# EAGLE board A20-OLinuXino-Lime2_Rev_K (EAGLE 4.16), part 1 of 6
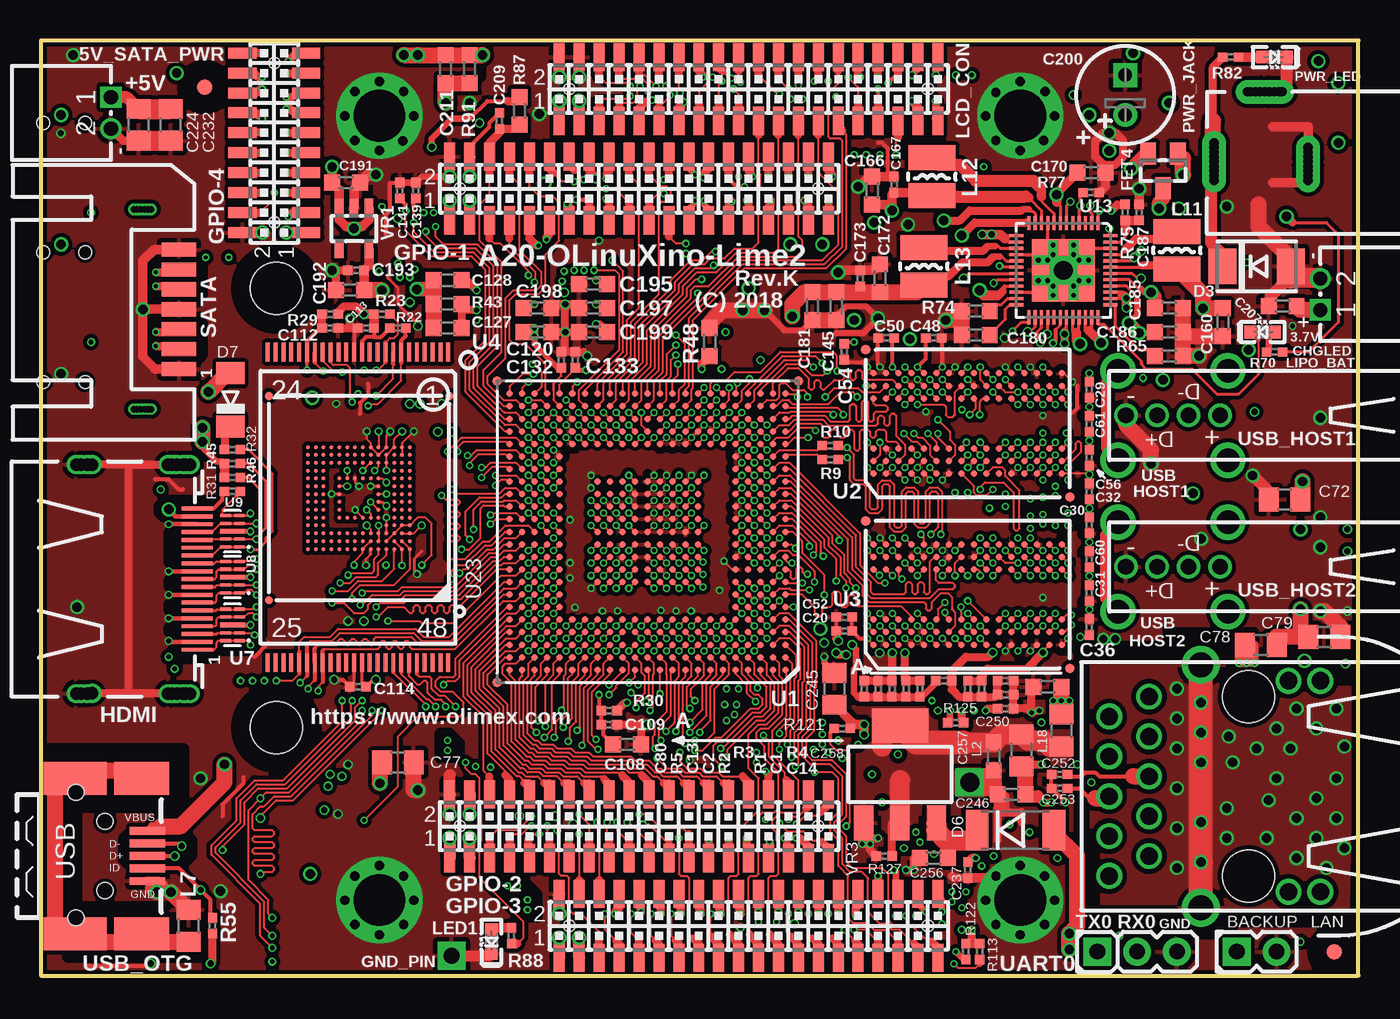
[diagram p5: board, top side]
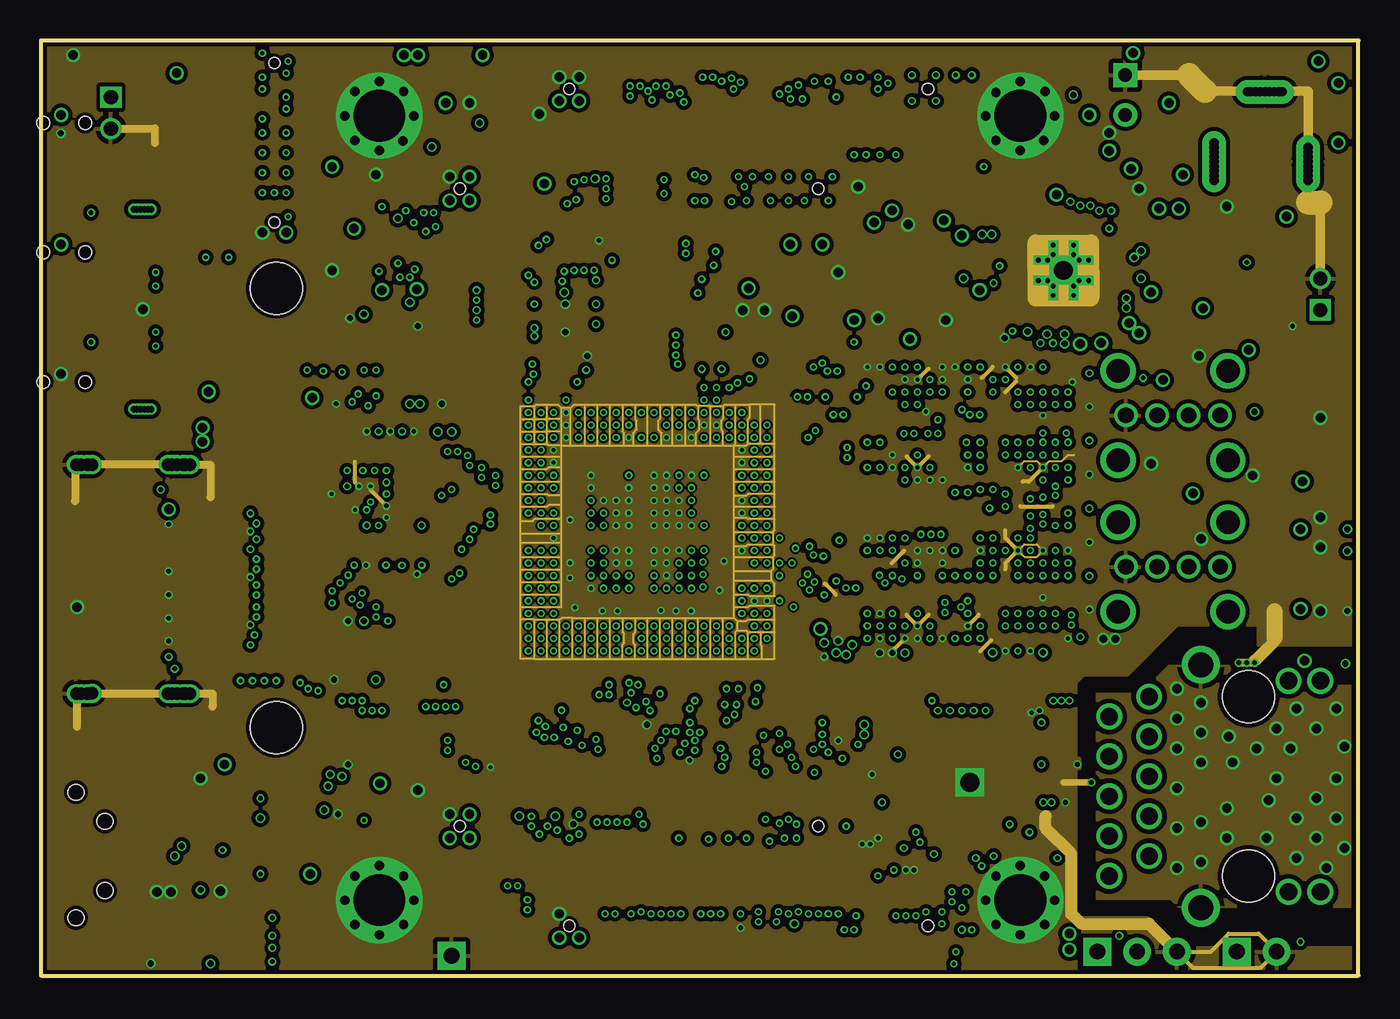
[diagram p6: board, inner layer GND]
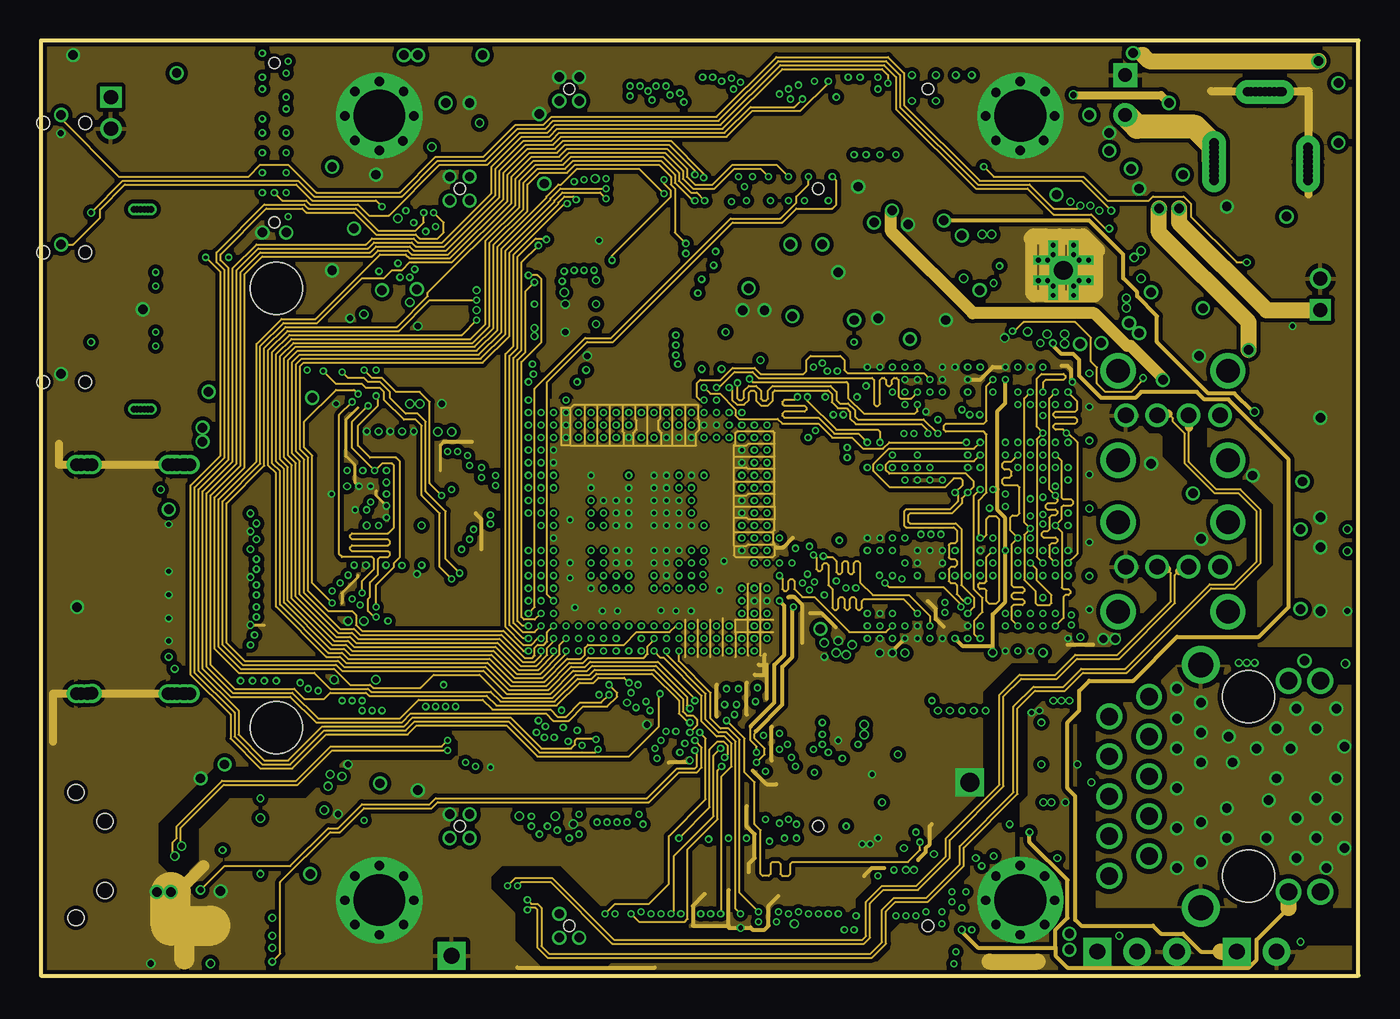
[diagram p7: board, inner layer Route3]
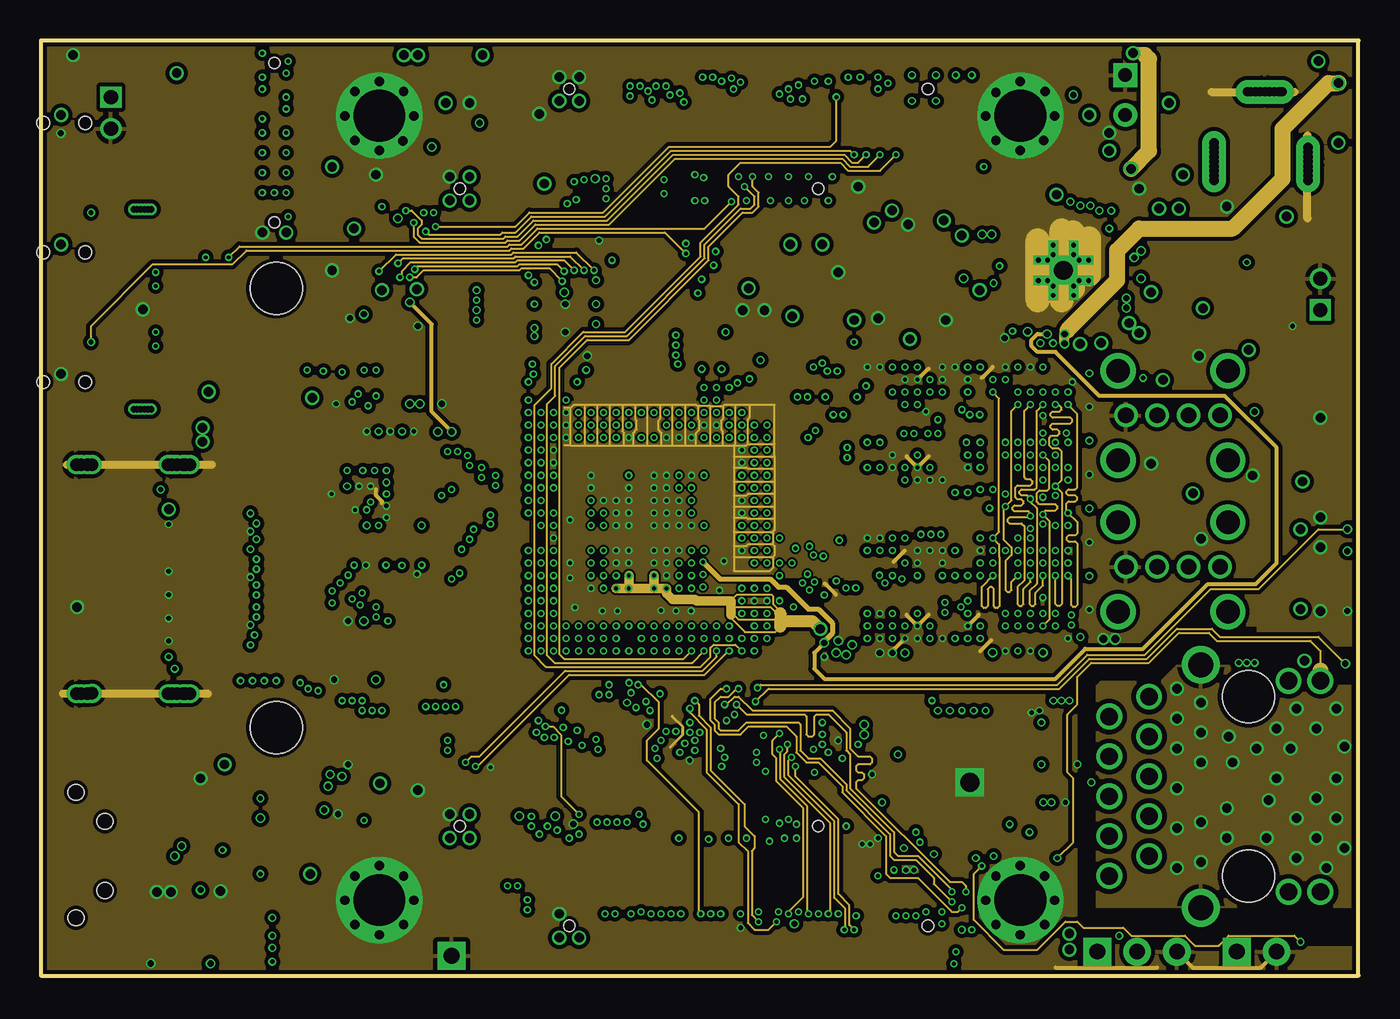
[diagram p8: board, inner layer Route4]
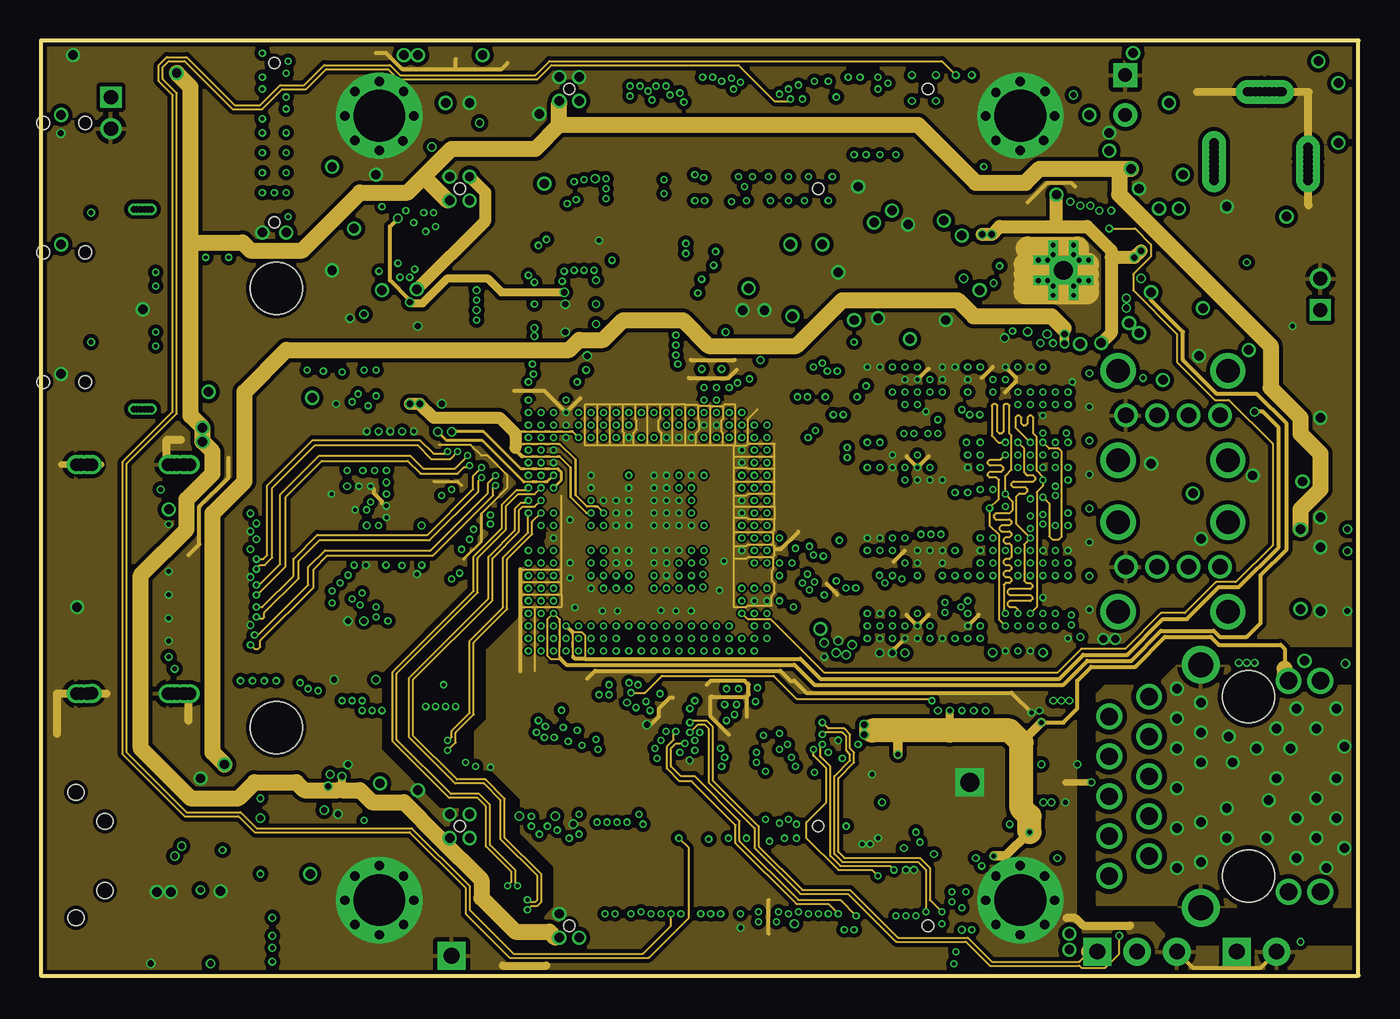
[diagram p9: board, inner layer Route13]
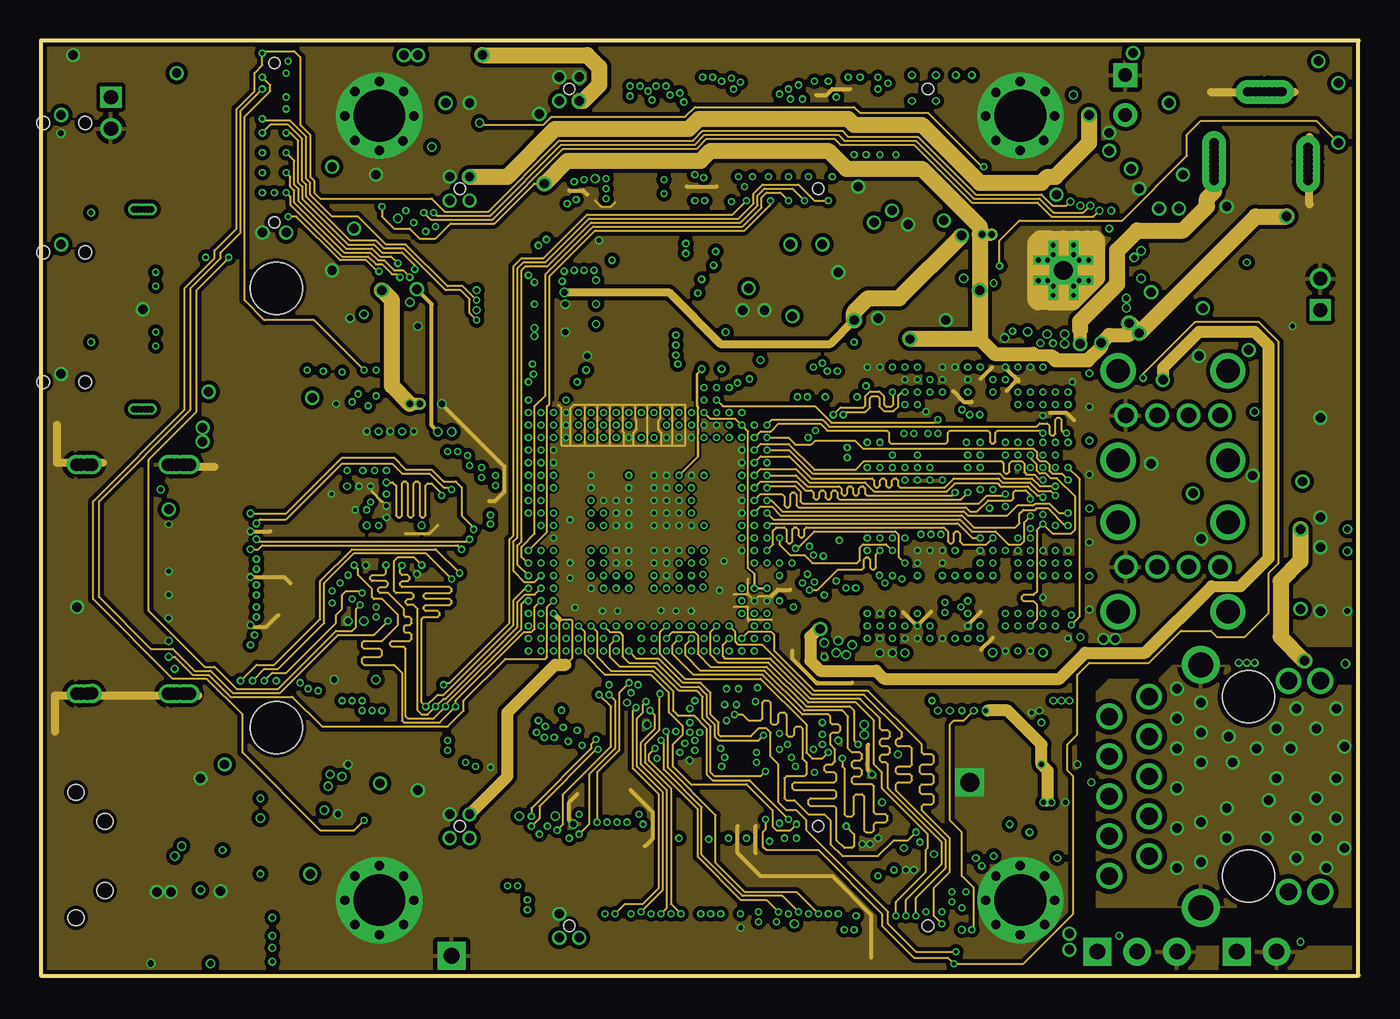
[diagram p10: board, inner layer Route14]
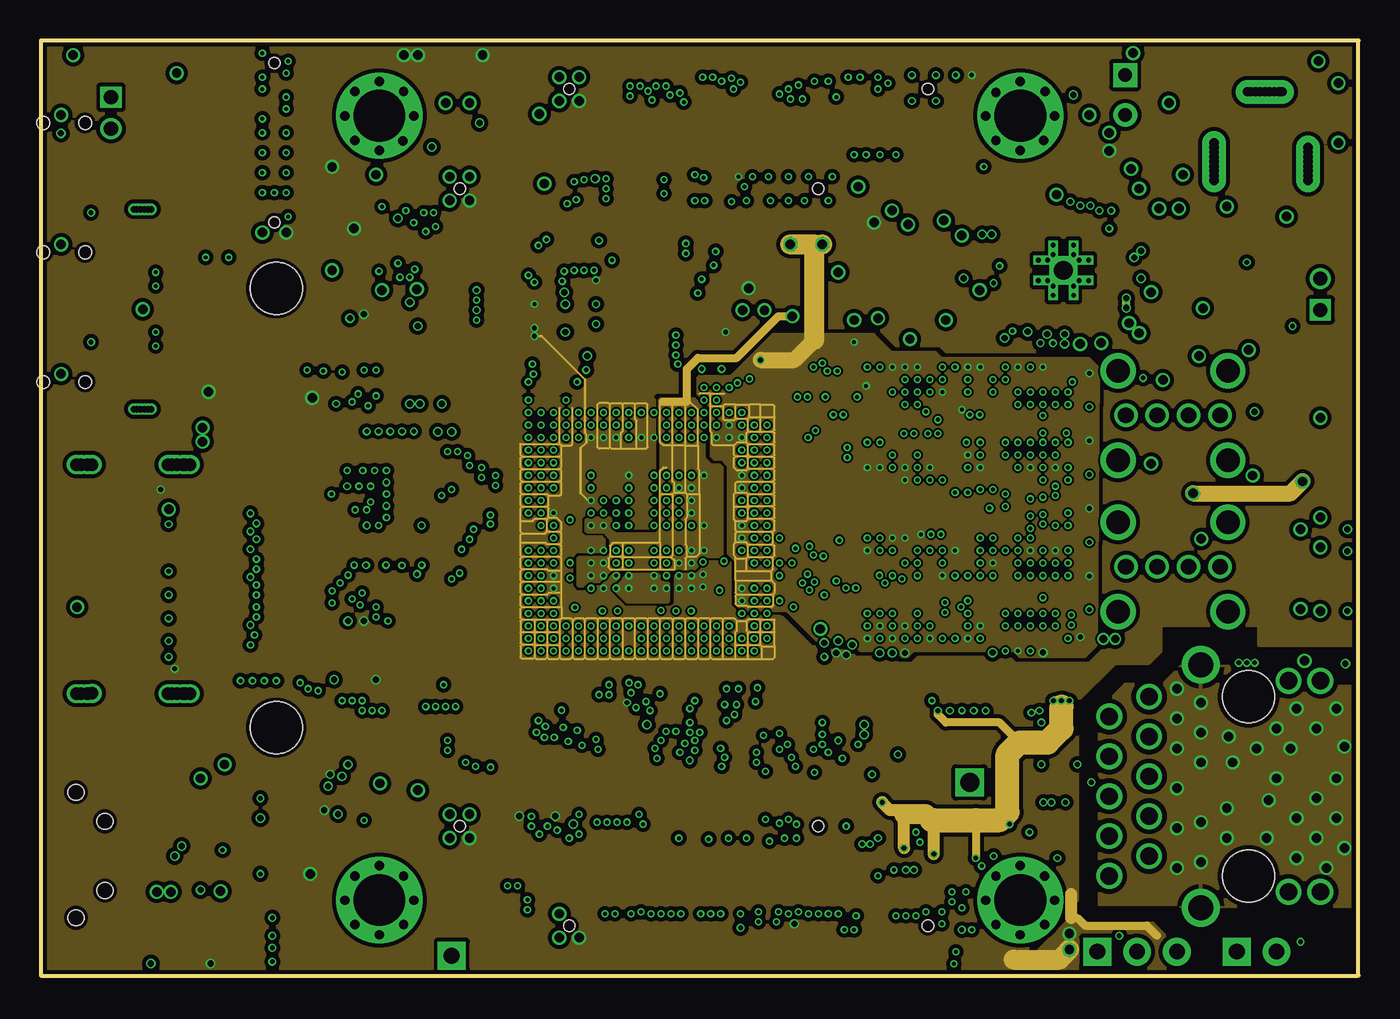
[diagram p11: board, inner layer PWR]
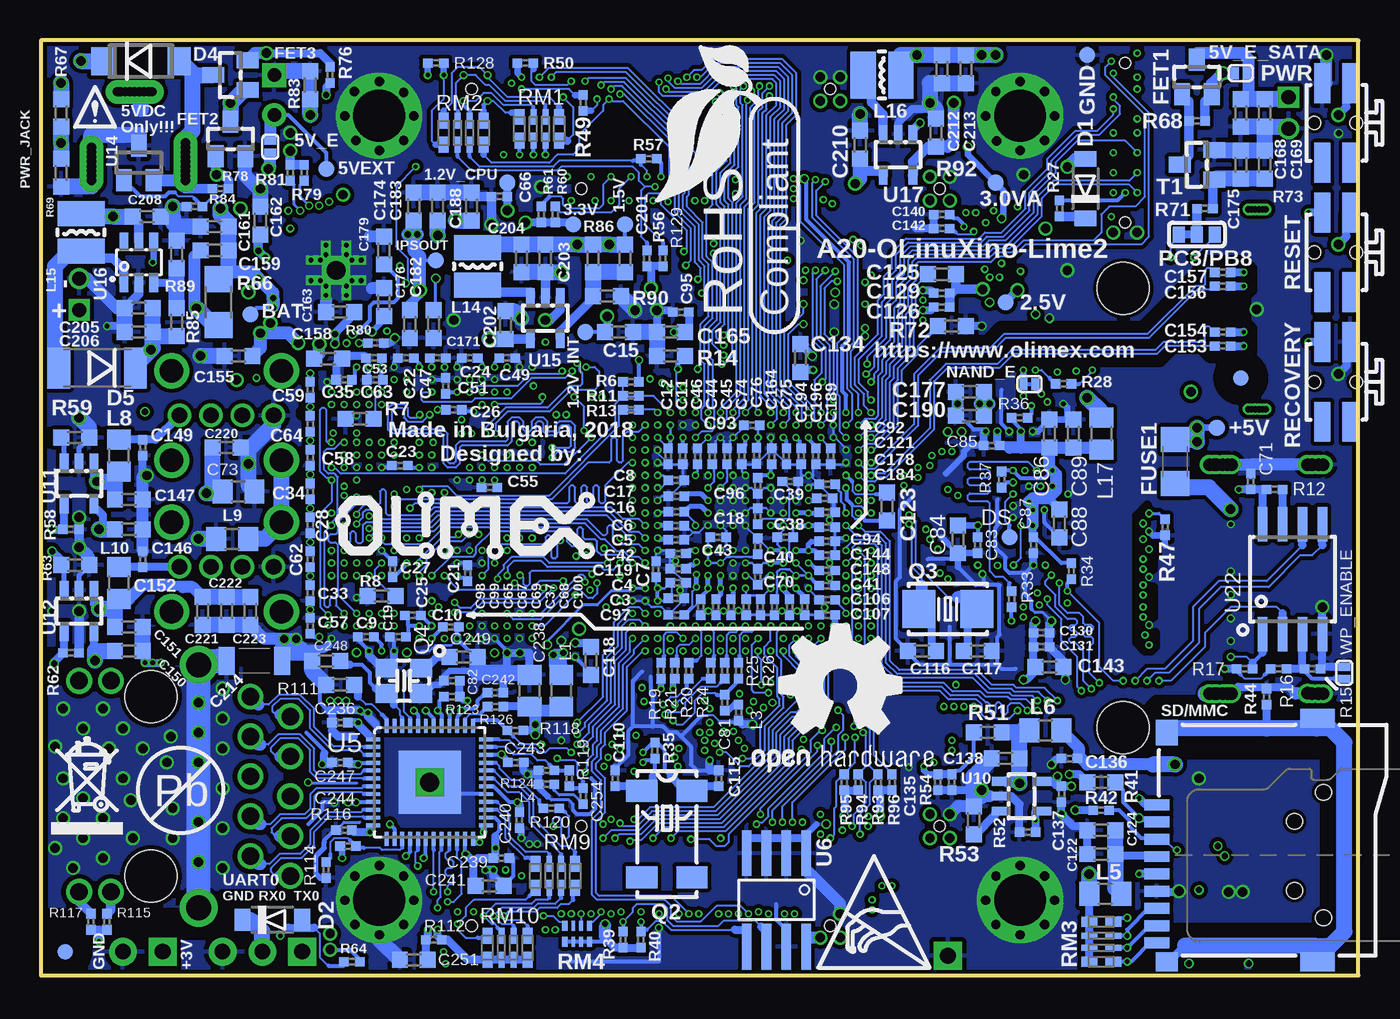
[diagram p12: board, bottom side, seen from below]

Size 83.96 x 59.61 mm. Coordinates in mm from the lower left corner, seen from the top.
Copper layers (1+2*3+4*13+14*15+16): Top 0.035mm / dielectric 0.12mm / GND 0.035mm / dielectric 0.2mm / Route3 0.035mm / dielectric 0.28mm / Route4 0.035mm / dielectric 0.2mm / Route13 0.035mm / dielectric 0.28mm / Route14 0.035mm / dielectric 0.2mm / PWR 0.035mm / dielectric 0.12mm / Bottom 0.035mm
Design rules "default": minimum track width 4.5mil, minimum drill 10mil, track to track 5mil, track to pad 5mil, pad to pad 5mil, via to via 5mil, smd to smd 1mil, copper to edge 10mil, drill to drill 8mil, minimum pad ring 6mil, minimum via ring 4mil, stop-mask expansion 4mil, vias tented up to drill 25mil, thermal gap 12mil
Net classes: 2 lan_sh: drill 0.762 mm
tRestrict: 171 lines
bRestrict: 117 lines

## Footprints (pad centres in the part's own frame; a part is rotated, then mirrored left to right if it is on the bottom)
TESTPAD_40-ROUND = smd 1.016 x 1.016: 1 0,0
SJ_1_SMALLER = smd 0.508 x 0.762: 1 -0.381,0; 2 0.381,0
DW02R = drill 0.9 square: 1 -1,0 | drill 0.9 round: 2 1,0
HN1X2 = drill 1 pad 1.778 square: 1 -1.27,0 | drill 1 pad 1.778 round: 2 1.27,0
HAMMOND_1593LBK_A10_LIME_METALBOX = drill 3.3 pad 5.5 round: SH0 21.55,54.81; SH9 62.41,54.81; SH18 21.55,4.81; SH27 62.41,4.81 | drill 0.6 pad 0.9 round: SH1 21.55,57; SH2 23.1,56.35; SH3 23.75,54.8; SH4 23.05,53.2; SH5 21.55,52.6; SH6 20,53.25; SH7 19.35,54.8; SH8 20,56.35; SH10 62.4,57; SH11 64,56.35; SH12 64.6,54.8; SH13 63.9,53.25; SH14 62.4,52.6; SH15 60.85,53.25; SH16 60.2,54.8; SH17 60.85,56.3; SH19 21.55,7; SH20 23.1,6.35; SH21 23.75,4.8; SH22 23.1,3.25; SH23 21.55,2.6; SH24 20,3.25; SH25 19.35,4.8; SH26 20,6.35; SH28 62.4,7; SH29 63.95,6.35; SH30 64.6,4.8; SH31 63.95,3.25; SH32 62.4,2.6; SH33 60.85,3.25; SH34 60.2,4.8; SH35 60.85,6.35 | hole 3.3: 14.98,15.81; 14.98,43.81
C0402_TI = smd 0.61 x 0.584: 1 -0.508,0; 2 0.508,0
C0603_DWS = smd 1.016 x 1.016: 1 -0.889,0; 2 0.889,0
C0805_5MIL_DWS = smd 1.27 x 1.524: 1 -1.016,0; 2 1.016,0
E2,5-6,3 = drill 0.864 pad 1.524 round: + -1.27,0 | drill 0.864 pad 1.524 square: - 1.27,0
C1206_5MILS_WS_ISO = smd 1.016 x 1.778: 1 -1.778,0; 2 1.778,0
LED-0603_TEST = smd 0.8 x 0.8: A 0.762,0; C -0.762,0
SOD-123 = smd 1 x 1.4: A 1.9,0; C -1.9,0
DO214AA = smd 1.778 x 2.286: A 2.177,0; C -2.177,0
MLL-41 = smd 1.45 x 1.8: A 2.445,0; K -2.445,0
MELF-MLL41 = smd 1.45 x 2.6: 1 -2.445,0; 2 2.445,0
MINI-MELF = smd 1.4 x 1.8: A 1.7,0; C -1.7,0
SOT23 = smd 1.4 x 1: 1 1.1,-0.95; 2 1.1,0.95; 3 -1.1,0
1206 = smd 1.6 x 1.8: 1 -1.4,0; 2 1.4,0
TEST_PAD40/70/SQUARE = drill 1.016 pad 1.778 square: P$1 0,0
GPH127SMT-02X20(PA-V16X-2X20-LF)_TEST = smd 0.7 x 1.8: 1 -12.065,-2.032; 2 -12.065,2.032; 3 -10.795,-2.032; 4 -10.795,2.032; 5 -9.525,-2.032; 6 -9.525,2.032; 7 -8.255,-2.032; 8 -8.255,2.032; 9 -6.985,-2.032; 10 -6.985,2.032; 11 -5.715,-2.032; 12 -5.715,2.032; 13 -4.445,-2.032; 14 -4.445,2.032; 15 -3.175,-2.032; 16 -3.175,2.032; 17 -1.905,-2.032; 18 -1.905,2.032; 19 -0.635,-2.032; 20 -0.635,2.032; 21 0.635,-2.032; 22 0.635,2.032; 23 1.905,-2.032; 24 1.905,2.032; 25 3.175,-2.032; 26 3.175,2.032; 27 4.445,-2.032; 28 4.445,2.032; 29 5.715,-2.032; 30 5.715,2.032; 31 6.985,-2.032; 32 6.985,2.032; 33 8.255,-2.032; 34 8.255,2.032; 35 9.525,-2.032; 36 9.525,2.032; 37 10.795,-2.032; 38 10.795,2.032; 39 12.065,-2.032; 40 12.065,2.032 | hole 0.7: -11.43,0; 11.43,0
GPH127SMT-02X10(PA-V16X-2X10-LF)_TEST = smd 0.7 x 1.8: 1 -5.715,-2.032; 2 -5.715,2.032; 3 -4.445,-2.032; 4 -4.445,2.032; 5 -3.175,-2.032; 6 -3.175,2.032; 7 -1.905,-2.032; 8 -1.905,2.032; 9 -0.635,-2.032; 10 -0.635,2.032; 11 0.635,-2.032; 12 0.635,2.032; 13 1.905,-2.032; 14 1.905,2.032; 15 3.175,-2.032; 16 3.175,2.032; 17 4.445,-2.032; 18 4.445,2.032; 19 5.715,-2.032; 20 5.715,2.032 | hole 0.7: -5.08,0; 5.08,0
HDMI-SWM-19_TEST = smd 0.25 x 2: 1 -4.5,-5.75; 2 -4,-5.75; 3 -3.5,-5.75; 4 -3,-5.75; 5 -2.5,-5.75; 6 -2,-5.75; 7 -1.5,-5.75; 8 -1,-5.75; 9 -0.5,-5.75; 10 0,-5.75; 11 0.5,-5.75; 12 1,-5.75; 13 1.5,-5.75; 14 2,-5.75; 15 2.5,-5.75; 16 3,-5.75; 17 3.5,-5.75; 18 4,-5.75; 19 4.5,-5.75 | drill 0.8 round: P$5 -7.3,-4.85; P$7 -7.3,1.25; P$9 7.3,1.25; P$11 7.3,-4.85; P$13 -7.3,-4.45; P$15 -7.3,1.65; P$18 7.3,1.65; P$20 7.3,-4.45; P$21 -7.3,-4.15; P$22 -7.3,-5; P$23 7.3,-5; P$24 7.3,-4.15; P$25 -7.3,-5.3; P$26 7.3,-5.3; P$27 7.3,0.95; P$28 -7.275,0.95; SH1 -7.3,-3.9; SH2 -7.3,1.95; SH3 7.3,1.95; SH4 7.3,-3.9
L0805_5MIL_DWS = smd 1.27 x 1.524: 1 -1.016,0; 2 1.016,0
L0402_TI = smd 0.61 x 0.584: 1 -0.508,0; 2 0.508,0
CD32 = smd 1.6 x 3: 1 -1.2,0; 2 1.2,0
TM211Q01FM22_SH = drill 1.1 round: 1 -5.715,-6.35; 2 -4.445,-8.89; 3 -3.175,-6.35; 4 -1.905,-8.89; 5 -0.635,-6.35; 6 0.635,-8.89; 7 1.905,-6.35; 8 3.175,-8.89; 9 4.445,-6.35; 10 5.715,-8.89; 11 -6.731,2.54; 12 -6.731,4.572; 13 6.731,2.54; 14 6.731,4.572 | drill 1.6 round: SH1 -7.747,-3.048; SH2 7.747,-3.048 | hole 3.3: 5.715,0; -5.715,0
SJ_1_SMALLER_CLOSE_10MILS = smd 0.508 x 0.762: 1 -0.381,0; 2 0.381,0
SJ_2_SMALL_23_TIED = smd 0.762 x 1.016: 1 -1.143,0; 2 0,0; 3 1.143,0
SW_TAKT3X4 = smd 2.54 x 1.016: 1_1 2.54,-0.889; 1_2 -2.54,-0.889; 2_1 2.54,0.889; 2_2 -2.54,0.889 | hole 0.8: 0,1.397; 0,-1.27
PWR_JACK_UNI_MILLING_SMALLER_DRILLS = drill 0.6 pad 1.5 round: + -0.196,4.75; +1 -0.196,5.05; +2 -0.196,5.35; +3 -0.196,5.65; +4 -0.196,4.45; +5 -0.196,4.15; +6 -0.196,3.85; +7 -0.196,3.55; +8 -0.196,5.95; - -6.196,4.75; -1 -6.196,5.05; -2 -6.196,5.35; -3 -6.196,4.45; -4 -6.196,4.15; -5 -6.196,5.65; -6 -6.196,3.85; -8 -6.196,5.95; -- -3.446,0.3; --1 -3.746,0.3; --2 -4.046,0.3; --3 -4.346,0.3; --4 -3.146,0.3; --5 -2.846,0.3; --6 -2.546,0.3; --14 -4.546,0.3; --15 -2.346,0.3
MC-306_TEST = smd 1.4 x 2: 1 -2.75,-1.6; 2 2.75,-1.6; 3 2.75,1.6; 4 -2.75,1.6
HCX-4S_TEST = smd 2.1 x 2.4: 1 -1.85,0; 2 1.85,0
NX3225SA = smd 1.4 x 1.2: 1 -1.1,-0.8; 2 1.1,0.8; NC_1 1.1,-0.8; NC_2 -1.1,0.8
R0402_TI = smd 0.61 x 0.584: 1 -0.508,0; 2 0.508,0
R0603_5MIL_DWS = smd 1.016 x 1.016: 1 -0.889,0; 2 0.889,0
R0402_TI_0R = smd 0.61 x 0.584: 1 -0.508,0; 2 0.508,0
R1206_5MIL_WS = smd 1.651 x 1.778: 1 -1.46,0; 2 1.46,0
0603_0R = smd 1.016 x 1.016: 1 -0.889,0; 2 0.889,0
R_MATRIX_4 = smd 0.635 x 1.016: 1.1 -1.27,-0.762; 1.2 -1.27,0.762; 4.1 1.27,-0.762; 4.2 1.27,0.762 | smd 0.381 x 1.016: 2.1 -0.381,-0.762; 2.2 -0.381,0.762; 3.1 0.381,-0.762; 3.2 0.381,0.762
R_MATRIX_4_0402_25X625_BIGGEROUTPADS = smd 0.325 x 0.625: 1.1 -0.79,-0.512; 1.2 -0.79,0.512; 4.1 0.79,-0.512; 4.2 0.79,0.512 | smd 0.25 x 0.625: 2.1 -0.25,-0.512; 2.2 -0.25,0.512; 3.1 0.25,-0.512; 3.2 0.25,0.512
SATA-PWA-07-TEST = smd 0.9 x 2.2: 1 -4.25,-4.8; 2 -2.98,-4.8; 3 -1.71,-4.8; 4 -0.44,-4.8; 5 0.83,-4.8; 6 2.1,-4.8; 7 3.37,-4.8 | drill 0.4 round: P$1 -6.81,-2.35; P$2 -6.81,-2.125; P$3 -6.81,-2.6; P$4 -6.81,-1.925; P$5 -6.81,-3.025; P$11 5.93,-2.35; P$20 5.93,-2.125; P$23 5.93,-2.6; P$24 5.93,-1.925; P$26 5.93,-3.025; SH1 -6.81,-2.825; SH4 5.93,-2.825
TFC-WPAPR-08_BIGGER_CREAM = smd 1.6 x 0.7: 1 -6.994,2.25; 2 -6.994,1.15; 3 -6.994,0.05; 4 -6.994,-1.05; 5 -6.994,-2.15; 6 -6.994,-3.25; 7 -6.994,-4.35; 8 -6.994,-5.45; 9 -6.994,-6.55 | smd 1.4 x 1.2: 10 -6.369,-7.75 | smd 1.4 x 1.6: 11 -6.369,6.85 | smd 2.2 x 1.2: 12 3.231,-7.75; 13 3.231,7.75 | hole 1: 3.631,-4.95; 3.631,3.05
TFBGA441 = smd 0.4 x 0.4: A1 -8.8,-8.8; A2 -8.8,-8; A3 -8.8,-7.2; A4 -8.8,-6.4; A5 -8.8,-5.6; A6 -8.8,-4.8; A7 -8.8,-4; A8 -8.8,-3.2; A9 -8.8,-2.4; A10 -8.8,-1.6; A11 -8.8,-0.8; A12 -8.8,0; A13 -8.8,0.8; A14 -8.8,1.6; A15 -8.8,2.4; A16 -8.8,3.2; A17 -8.8,4; A18 -8.8,4.8; A19 -8.8,5.6; A20 -8.8,6.4; A21 -8.8,7.2; A22 -8.8,8; A23 -8.8,8.8; AA1 7.2,-8.8; AA2 7.2,-8; AA3 7.2,-7.2; AA4 7.2,-6.4; AA5 7.2,-5.6; AA6 7.2,-4.8; AA7 7.2,-4; AA8 7.2,-3.2; AA9 7.2,-2.4; AA10 7.2,-1.6; AA11 7.2,-0.8; AA12 7.2,0; AA13 7.2,0.8; AA14 7.2,1.6; AA15 7.2,2.4; AA16 7.2,3.2; AA17 7.2,4; AA18 7.2,4.8; AA19 7.2,5.6; AA20 7.2,6.4; AA21 7.2,7.2; AA22 7.2,8; AA23 7.2,8.8; AB1 8,-8.8; AB2 8,-8; AB3 8,-7.2; AB4 8,-6.4; AB5 8,-5.6; AB6 8,-4.8; AB7 8,-4; AB8 8,-3.2; AB9 8,-2.4; AB10 8,-1.6; AB11 8,-0.8; AB12 8,0; AB13 8,0.8; AB14 8,1.6; AB15 8,2.4; AB16 8,3.2; AB17 8,4; AB18 8,4.8; AB19 8,5.6; AB20 8,6.4; AB21 8,7.2; AB22 8,8; AB23 8,8.8; AC1 8.8,-8.8; AC2 8.8,-8; AC3 8.8,-7.2; AC4 8.8,-6.4; AC5 8.8,-5.6; AC6 8.8,-4.8; AC7 8.8,-4; AC8 8.8,-3.2; AC9 8.8,-2.4; AC10 8.8,-1.6; AC11 8.8,-0.8; AC12 8.8,0; AC13 8.8,0.8; AC14 8.8,1.6; AC15 8.8,2.4; AC16 8.8,3.2; AC17 8.8,4; AC18 8.8,4.8; AC19 8.8,5.6; AC20 8.8,6.4; AC21 8.8,7.2; AC22 8.8,8; AC23 8.8,8.8; B1 -8,-8.8; B2 -8,-8; B3 -8,-7.2; B4 -8,-6.4; B5 -8,-5.6; B6 -8,-4.8; B7 -8,-4; B8 -8,-3.2; B9 -8,-2.4; B10 -8,-1.6; B11 -8,-0.8; B12 -8,0; B13 -8,0.8; B14 -8,1.6; B15 -8,2.4; B16 -8,3.2; B17 -8,4; B18 -8,4.8; B19 -8,5.6; B20 -8,6.4; B21 -8,7.2; B22 -8,8; B23 -8,8.8; C1 -7.2,-8.8; C2 -7.2,-8; C3 -7.2,-7.2; C4 -7.2,-6.4; C5 -7.2,-5.6; C6 -7.2,-4.8; C7 -7.2,-4; C8 -7.2,-3.2; C9 -7.2,-2.4; C10 -7.2,-1.6; C11 -7.2,-0.8; C12 -7.2,0; C13 -7.2,0.8; C14 -7.2,1.6; C15 -7.2,2.4; C16 -7.2,3.2; C17 -7.2,4; C18 -7.2,4.8; C19 -7.2,5.6; C20 -7.2,6.4; C21 -7.2,7.2; C22 -7.2,8; C23 -7.2,8.8; D1 -6.4,-8.8; D2 -6.4,-8; D3 -6.4,-7.2; D4 -6.4,-6.4; D5 -6.4,-5.6; D6 -6.4,-4.8; D7 -6.4,-4; D8 -6.4,-3.2; D9 -6.4,-2.4; D10 -6.4,-1.6; D11 -6.4,-0.8; D12 -6.4,0; D13 -6.4,0.8; D14 -6.4,1.6; D15 -6.4,2.4; D16 -6.4,3.2; D17 -6.4,4; D18 -6.4,4.8; D19 -6.4,5.6; D20 -6.4,6.4; D21 -6.4,7.2; D22 -6.4,8; D23 -6.4,8.8; E1 -5.6,-8.8; E2 -5.6,-8; E3 -5.6,-7.2; E4 -5.6,-6.4; E5 -5.6,-5.6; E6 -5.6,-4.8; E7 -5.6,-4; E8 -5.6,-3.2; E9 -5.6,-2.4; E10 -5.6,-1.6; E11 -5.6,-0.8; E12 -5.6,0; E13 -5.6,0.8; E14 -5.6,1.6; E15 -5.6,2.4; E16 -5.6,3.2; E17 -5.6,4; E18 -5.6,4.8; E19 -5.6,5.6; E20 -5.6,6.4; E21 -5.6,7.2; E22 -5.6,8; E23 -5.6,8.8; F1 -4.8,-8.8; F2 -4.8,-8; F3 -4.8,-7.2; F4 -4.8,-6.4; F5 -4.8,-5.6; F19 -4.8,5.6; F20 -4.8,6.4; F21 -4.8,7.2; F22 -4.8,8; F23 -4.8,8.8; G1 -4,-8.8; G2 -4,-8; G3 -4,-7.2; G4 -4,-6.4; G5 -4,-5.6; G19 -4,5.6; G20 -4,6.4; G21 -4,7.2; G22 -4,8; G23 -4,8.8; H1 -3.2,-8.8; H2 -3.2,-8; H3 -3.2,-7.2; H4 -3.2,-6.4; H5 -3.2,-5.6; H8 -3.2,-3.2; H9 -3.2,-2.4; H10 -3.2,-1.6; H11 -3.2,-0.8; H12 -3.2,0; H13 -3.2,0.8; H14 -3.2,1.6; H15 -3.2,2.4; H16 -3.2,3.2; H19 -3.2,5.6; H20 -3.2,6.4; H21 -3.2,7.2; H22 -3.2,8; H23 -3.2,8.8; J1 -2.4,-8.8; J2 -2.4,-8; J3 -2.4,-7.2; J4 -2.4,-6.4; J5 -2.4,-5.6; J8 -2.4,-3.2; J9 -2.4,-2.4; J10 -2.4,-1.6; J11 -2.4,-0.8; J12 -2.4,0; J13 -2.4,0.8; J14 -2.4,1.6; J15 -2.4,2.4; J16 -2.4,3.2; J19 -2.4,5.6; J20 -2.4,6.4; J21 -2.4,7.2; J22 -2.4,8; J23 -2.4,8.8; K1 -1.6,-8.8; K2 -1.6,-8; K3 -1.6,-7.2; K4 -1.6,-6.4; K5 -1.6,-5.6; K8 -1.6,-3.2; K9 -1.6,-2.4; K10 -1.6,-1.6; K11 -1.6,-0.8; K12 -1.6,0; K13 -1.6,0.8; K14 -1.6,1.6; K15 -1.6,2.4; K16 -1.6,3.2; K19 -1.6,5.6; K20 -1.6,6.4; K21 -1.6,7.2; K22 -1.6,8; K23 -1.6,8.8; L1 -0.8,-8.8; L2 -0.8,-8; L3 -0.8,-7.2; L4 -0.8,-6.4; L5 -0.8,-5.6; L8 -0.8,-3.2; L9 -0.8,-2.4; L10 -0.8,-1.6; L11 -0.8,-0.8; L12 -0.8,0; L13 -0.8,0.8; L14 -0.8,1.6; L15 -0.8,2.4; L16 -0.8,3.2; L19 -0.8,5.6; L20 -0.8,6.4; L21 -0.8,7.2; L22 -0.8,8; L23 -0.8,8.8; M1 0,-8.8; M2 0,-8; M3 0,-7.2; M4 0,-6.4; M5 0,-5.6; M8 0,-3.2; M9 0,-2.4; M10 0,-1.6; M11 0,-0.8; M12 0,0; M13 0,0.8; M14 0,1.6; M15 0,2.4; M16 0,3.2; M19 0,5.6; M20 0,6.4; M21 0,7.2; M22 0,8; M23 0,8.8; N1 0.8,-8.8; N2 0.8,-8; N3 0.8,-7.2; N4 0.8,-6.4; N5 0.8,-5.6; N8 0.8,-3.2; N9 0.8,-2.4; N10 0.8,-1.6; N11 0.8,-0.8; N12 0.8,0; N13 0.8,0.8; N14 0.8,1.6; N15 0.8,2.4; N16 0.8,3.2; N19 0.8,5.6; N20 0.8,6.4; N21 0.8,7.2; N22 0.8,8; N23 0.8,8.8; P1 1.6,-8.8; P2 1.6,-8; P3 1.6,-7.2; P4 1.6,-6.4; P5 1.6,-5.6; P8 1.6,-3.2; P9 1.6,-2.4; P10 1.6,-1.6; P11 1.6,-0.8; P12 1.6,0; P13 1.6,0.8; P14 1.6,1.6; P15 1.6,2.4; P16 1.6,3.2; P19 1.6,5.6; P20 1.6,6.4; P21 1.6,7.2; P22 1.6,8; P23 1.6,8.8; R1 2.4,-8.8; R2 2.4,-8; R3 2.4,-7.2; R4 2.4,-6.4; R5 2.4,-5.6; R8 2.4,-3.2; R9 2.4,-2.4; R10 2.4,-1.6; R11 2.4,-0.8; R12 2.4,0; R13 2.4,0.8; R14 2.4,1.6; R15 2.4,2.4; R16 2.4,3.2; R19 2.4,5.6; R20 2.4,6.4; R21 2.4,7.2; R22 2.4,8; R23 2.4,8.8; T1 3.2,-8.8; T2 3.2,-8; T3 3.2,-7.2; T4 3.2,-6.4; T5 3.2,-5.6; T8 3.2,-3.2; T9 3.2,-2.4; T10 3.2,-1.6; T11 3.2,-0.8; T12 3.2,0; T13 3.2,0.8; T14 3.2,1.6; T15 3.2,2.4; T16 3.2,3.2; T19 3.2,5.6; T20 3.2,6.4; T21 3.2,7.2; T22 3.2,8; T23 3.2,8.8; U1 4,-8.8; U2 4,-8; U3 4,-7.2; U4 4,-6.4; U5 4,-5.6; U19 4,5.6; U20 4,6.4; U21 4,7.2; U22 4,8; U23 4,8.8; V1 4.8,-8.8; V2 4.8,-8; V3 4.8,-7.2; V4 4.8,-6.4; V5 4.8,-5.6; V19 4.8,5.6; V20 4.8,6.4; V21 4.8,7.2; V22 4.8,8; V23 4.8,8.8; W1 5.6,-8.8; W2 5.6,-8; W3 5.6,-7.2; W4 5.6,-6.4; W5 5.6,-5.6; W6 5.6,-4.8; W7 5.6,-4; W8 5.6,-3.2; W9 5.6,-2.4; W10 5.6,-1.6; W11 5.6,-0.8; W12 5.6,0; W13 5.6,0.8; W14 5.6,1.6; W15 5.6,2.4; W16 5.6,3.2; W17 5.6,4; W18 5.6,4.8; W19 5.6,5.6; W20 5.6,6.4; W21 5.6,7.2; W22 5.6,8; W23 5.6,8.8; Y1 6.4,-8.8; Y2 6.4,-8; Y3 6.4,-7.2; Y4 6.4,-6.4; Y5 6.4,-5.6; Y6 6.4,-4.8; Y7 6.4,-4; Y8 6.4,-3.2; Y9 6.4,-2.4; Y10 6.4,-1.6; Y11 6.4,-0.8; Y12 6.4,0; Y13 6.4,0.8; Y14 6.4,1.6; Y15 6.4,2.4; Y16 6.4,3.2; Y17 6.4,4; Y18 6.4,4.8; Y19 6.4,5.6; Y20 6.4,6.4; Y21 6.4,7.2; Y22 6.4,8; Y23 6.4,8.8 | smd 0.6 x 0.6: FID1 -9.6,9.6; FID2 9.6,9.6; FID3 9.6,-9.6
FBGA96_SK = smd 0.4 x 0.4: A1 -6,-3.2; A2 -6,-2.4; A3 -6,-1.6; A7 -6,1.6; A8 -6,2.4; A9 -6,3.2; B1 -5.2,-3.2; B2 -5.2,-2.4; B3 -5.2,-1.6; B7 -5.2,1.6; B8 -5.2,2.4; B9 -5.2,3.2; C1 -4.4,-3.2; C2 -4.4,-2.4; C3 -4.4,-1.6; C7 -4.4,1.6; C8 -4.4,2.4; C9 -4.4,3.2; D1 -3.6,-3.2; D2 -3.6,-2.4; D3 -3.6,-1.6; D7 -3.6,1.6; D8 -3.6,2.4; D9 -3.6,3.2; E1 -2.8,-3.2; E2 -2.8,-2.4; E3 -2.8,-1.6; E7 -2.8,1.6; E8 -2.8,2.4; E9 -2.8,3.2; F1 -2,-3.2; F2 -2,-2.4; F3 -2,-1.6; F7 -2,1.6; F8 -2,2.4; F9 -2,3.2; G1 -1.2,-3.2; G2 -1.2,-2.4; G3 -1.2,-1.6; G7 -1.2,1.6; G8 -1.2,2.4; G9 -1.2,3.2; H1 -0.4,-3.2; H2 -0.4,-2.4; H3 -0.4,-1.6; H7 -0.4,1.6; H8 -0.4,2.4; H9 -0.4,3.2; J1 0.4,-3.2; J2 0.4,-2.4; J3 0.4,-1.6; J7 0.4,1.6; J8 0.4,2.4; J9 0.4,3.2; K1 1.2,-3.2; K2 1.2,-2.4; K3 1.2,-1.6; K7 1.2,1.6; K8 1.2,2.4; K9 1.2,3.2; L1 2,-3.2; L2 2,-2.4; L3 2,-1.6; L7 2,1.6; L8 2,2.4; L9 2,3.2; M1 2.8,-3.2; M2 2.8,-2.4; M3 2.8,-1.6; M7 2.8,1.6; M8 2.8,2.4; M9 2.8,3.2; N1 3.6,-3.2; N2 3.6,-2.4; N3 3.6,-1.6; N7 3.6,1.6; N8 3.6,2.4; N9 3.6,3.2; P1 4.4,-3.2; P2 4.4,-2.4; P3 4.4,-1.6; P7 4.4,1.6; P8 4.4,2.4; P9 4.4,3.2; R1 5.2,-3.2; R2 5.2,-2.4; R3 5.2,-1.6; R7 5.2,1.6; R8 5.2,2.4; R9 5.2,3.2; T1 6,-3.2; T2 6,-2.4; T3 6,-1.6; T7 6,1.6; T8 6,2.4; T9 6,3.2 | smd 0.6 x 0.6: FID1 6.5,-4.7; FID2 -6.5,4.7
TSOP48 = smd 1.2 x 0.25: 1 -9.9,5.75; 2 -9.9,5.25; 3 -9.9,4.75; 4 -9.9,4.25; 5 -9.9,3.75; 6 -9.9,3.25; 7 -9.9,2.75; 8 -9.9,2.25; 9 -9.9,1.75; 10 -9.9,1.25; 11 -9.9,0.75; 12 -9.9,0.25; 13 -9.9,-0.25; 14 -9.9,-0.75; 15 -9.9,-1.25; 16 -9.9,-1.75; 17 -9.9,-2.25; 18 -9.9,-2.75; 19 -9.9,-3.25; 20 -9.9,-3.75; 21 -9.9,-4.25; 22 -9.9,-4.75; 23 -9.9,-5.25; 24 -9.9,-5.75; 25 9.9,-5.75; 26 9.9,-5.25; 27 9.9,-4.75; 28 9.9,-4.25; 29 9.9,-3.75; 30 9.9,-3.25; 31 9.9,-2.75; 32 9.9,-2.25; 33 9.9,-1.75; 34 9.9,-1.25; 35 9.9,-0.75; 36 9.9,-0.25; 37 9.9,0.25; 38 9.9,0.75; 39 9.9,1.25; 40 9.9,1.75; 41 9.9,2.25; 42 9.9,2.75; 43 9.9,3.25; 44 9.9,3.75; 45 9.9,4.25; 46 9.9,4.75; 47 9.9,5.25; 48 9.9,5.75
QFN48_1DRILL(PADPITCH-0.5MM) = smd 0.25 x 0.9: 1 -2.75,-3.6; 2 -2.25,-3.6; 3 -1.75,-3.6; 4 -1.25,-3.6; 5 -0.75,-3.6; 6 -0.25,-3.6; 7 0.25,-3.6; 8 0.75,-3.6; 9 1.25,-3.6; 10 1.75,-3.6; 11 2.25,-3.6; 12 2.75,-3.6; 25 2.75,3.6; 26 2.25,3.6; 27 1.75,3.6; 28 1.25,3.6; 29 0.75,3.6; 30 0.25,3.6; 31 -0.25,3.6; 32 -0.75,3.6; 33 -1.25,3.6; 34 -1.75,3.6; 35 -2.25,3.6; 36 -2.75,3.6 | smd 0.9 x 0.25: 13 3.6,-2.75; 14 3.6,-2.25; 15 3.6,-1.75; 16 3.6,-1.25; 17 3.6,-0.75; 18 3.6,-0.25; 19 3.6,0.25; 20 3.6,0.75; 21 3.6,1.25; 22 3.6,1.75; 23 3.6,2.25; 24 3.6,2.75; 37 -3.6,2.75; 38 -3.6,2.25; 39 -3.6,1.75; 40 -3.6,1.25; 41 -3.6,0.75; 42 -3.6,0.25; 43 -3.6,-0.25; 44 -3.6,-0.75; 45 -3.6,-1.25; 46 -3.6,-1.75; 47 -3.6,-2.25; 48 -3.6,-2.75 | smd 4 x 4: EP 0,0 | drill 1.2 pad 1.422 square: N1 0,0
SO-08MN = smd 0.61 x 2.921: 1 -1.905,-2.981; 2 -0.635,-2.981; 3 0.635,-2.981; 4 1.905,-2.981; 5 1.905,2.981; 6 0.635,2.981; 7 -0.635,2.981; 8 -1.905,2.981
SLP2510P8_TEST = smd 0.2 x 0.675: 1 -1,-0.438; 2 -0.5,-0.438; 4 0.5,-0.438; 5 1,-0.438; 6 1,0.438; 7 0.5,0.438; 9 -0.5,0.438; 10 -1,0.438 | smd 0.3 x 0.775: 3 0,-0.388; 8 0,0.388
SOT23-5 = smd 1.2 x 0.55: 1 1.3,-0.95; 2 1.3,0; 3 1.3,0.95; 4 -1.3,0.95; 5 -1.3,-0.95
QFN48 = smd 0.2 x 0.9: 1 -2.2,-3; 2 -1.8,-3; 3 -1.4,-3; 4 -1,-3; 5 -0.6,-3; 6 -0.2,-3; 7 0.2,-3; 8 0.6,-3; 9 1,-3; 10 1.4,-3; 11 1.8,-3; 12 2.2,-3; 25 2.2,3; 26 1.8,3; 27 1.4,3; 28 1,3; 29 0.6,3; 30 0.2,3; 31 -0.2,3; 32 -0.6,3; 33 -1,3; 34 -1.4,3; 35 -1.8,3; 36 -2.2,3 | smd 0.9 x 0.2: 13 3,-2.2; 14 3,-1.8; 15 3,-1.4; 16 3,-1; 17 3,-0.6; 18 3,-0.2; 19 3,0.2; 20 3,0.6; 21 3,1; 22 3,1.4; 23 3,1.8; 24 3,2.2; 37 -3,2.2; 38 -3,1.8; 39 -3,1.4; 40 -3,1; 41 -3,0.6; 42 -3,0.2; 43 -3,-0.2; 44 -3,-0.6; 45 -3,-1; 46 -3,-1.4; 47 -3,-1.8; 48 -3,-2.2 | drill 1.2 pad 1.422 square: N1 0,0 | drill 0.3 pad 0.4 square: N2 -1.6,0.65; N3 -1,0.65; N4 -1.6,-0.65; N5 -1,-0.65; N6 -0.65,-1.6; N7 -0.65,-1; N8 0.65,-1.6; N9 0.65,-1; N10 1.6,-0.65; N11 1,-0.65; N12 1.6,0.65; N13 1,0.65; N14 0.65,1.6; N15 0.65,1; N16 -0.65,1.6; N17 -0.65,1 | smd 4 x 4: VSS 0,0
SOT23-6 = smd 1.2 x 0.55: 1 1.3,-0.95; 2 1.3,0; 3 1.3,0.95; 4 -1.3,0.95; 5 -1.3,0; 6 -1.3,-0.95
FIDUCIAL-1X3 = smd 1 x 1: 1 0,0
SO-8-BIG = smd 0.6 x 2.2: 1 -1.905,-3.5; 2 -0.635,-3.5; 3 0.635,-3.5; 4 1.905,-3.5; 5 1.905,3.5; 6 0.635,3.5; 7 -0.635,3.5; 8 -1.905,3.5
FBGA153 = smd 0.25 x 0.25: A1 -3.25,-3.25; A2 -3.25,-2.75; A3 -3.25,-2.25; A4 -3.25,-1.75; A5 -3.25,-1.25; A6 -3.25,-0.75; A7 -3.25,-0.25; A8 -3.25,0.25; A9 -3.25,0.75; A10 -3.25,1.25; A11 -3.25,1.75; A12 -3.25,2.25; A13 -3.25,2.75; A14 -3.25,3.25; B1 -2.75,-3.25; B2 -2.75,-2.75; B3 -2.75,-2.25; B4 -2.75,-1.75; B5 -2.75,-1.25; B6 -2.75,-0.75; B7 -2.75,-0.25; B8 -2.75,0.25; B9 -2.75,0.75; B10 -2.75,1.25; B11 -2.75,1.75; B12 -2.75,2.25; B13 -2.75,2.75; B14 -2.75,3.25; C1 -2.25,-3.25; C2 -2.25,-2.75; C3 -2.25,-2.25; C4 -2.25,-1.75; C5 -2.25,-1.25; C6 -2.25,-0.75; C7 -2.25,-0.25; C8 -2.25,0.25; C9 -2.25,0.75; C10 -2.25,1.25; C11 -2.25,1.75; C12 -2.25,2.25; C13 -2.25,2.75; C14 -2.25,3.25; D1 -1.75,-3.25; D2 -1.75,-2.75; D3 -1.75,-2.25; D4 -1.75,-1.75; D12 -1.75,2.25; D13 -1.75,2.75; D14 -1.75,3.25; E1 -1.25,-3.25; E2 -1.25,-2.75; E3 -1.25,-2.25; E5 -1.25,-1.25; E6 -1.25,-0.75; E7 -1.25,-0.25; E8 -1.25,0.25; E9 -1.25,0.75; E10 -1.25,1.25; E12 -1.25,2.25; E13 -1.25,2.75; E14 -1.25,3.25; F1 -0.75,-3.25; F2 -0.75,-2.75; F3 -0.75,-2.25; F5 -0.75,-1.25; F10 -0.75,1.25; F12 -0.75,2.25; F13 -0.75,2.75; F14 -0.75,3.25; G1 -0.25,-3.25; G2 -0.25,-2.75; G3 -0.25,-2.25; G5 -0.25,-1.25; G10 -0.25,1.25; G12 -0.25,2.25; G13 -0.25,2.75; G14 -0.25,3.25; H1 0.25,-3.25; H2 0.25,-2.75; H3 0.25,-2.25; H5 0.25,-1.25; H10 0.25,1.25; H12 0.25,2.25; H13 0.25,2.75; H14 0.25,3.25; J1 0.75,-3.25; J2 0.75,-2.75; J3 0.75,-2.25; J5 0.75,-1.25; J10 0.75,1.25; J12 0.75,2.25; J13 0.75,2.75; J14 0.75,3.25; K1 1.25,-3.25; K2 1.25,-2.75; K3 1.25,-2.25; K5 1.25,-1.25; K6 1.25,-0.75; K7 1.25,-0.25; K8 1.25,0.25; K9 1.25,0.75; K10 1.25,1.25; K12 1.25,2.25; K13 1.25,2.75; K14 1.25,3.25; L1 1.75,-3.25; L2 1.75,-2.75; L3 1.75,-2.25; L12 1.75,2.25; L13 1.75,2.75; L14 1.75,3.25; M1 2.25,-3.25; M2 2.25,-2.75; M3 2.25,-2.25; M4 2.25,-1.75; M5 2.25,-1.25; M6 2.25,-0.75; M7 2.25,-0.25; M8 2.25,0.25; M9 2.25,0.75; M10 2.25,1.25; M11 2.25,1.75; M12 2.25,2.25; M13 2.25,2.75; M14 2.25,3.25; N1 2.75,-3.25; N2 2.75,-2.75; N3 2.75,-2.25; N4 2.75,-1.75; N5 2.75,-1.25; N6 2.75,-0.75; N7 2.75,-0.25; N8 2.75,0.25; N9 2.75,0.75; N10 2.75,1.25; N11 2.75,1.75; N12 2.75,2.25; N13 2.75,2.75; N14 2.75,3.25; P1 3.25,-3.25; P2 3.25,-2.75; P3 3.25,-2.25; P4 3.25,-1.75; P5 3.25,-1.25; P6 3.25,-0.75; P7 3.25,-0.25; P8 3.25,0.25; P9 3.25,0.75; P10 3.25,1.25; P11 3.25,1.75; P12 3.25,2.25; P13 3.25,2.75; P14 3.25,3.25 | smd 0.5 x 0.5: FID1 -6.5,5.75; FID2 6.5,5.75; FID3 6.5,-5.75
HN1X3 = drill 1 pad 1.778 square: 1 -2.54,0 | drill 1 pad 1.778 round: 2 0,0; 3 2.54,0
USB_A_VERTICAL_PTH = drill 1 round: 1 3.45,12.75; 2 3.45,14.75; 3 3.45,16.75; 4 3.45,18.75 | drill 1.5 round: P$1 0.6,12.25; P$2 6.3,12.25; P$3 6.3,19.25; P$4 0.6,19.25
USB_MINI_9PIN = smd 2.25 x 0.5: D+ -3.722,0; D- -3.722,-0.8; GND -3.722,1.6; ID -3.722,0.8; VBUS -3.722,-1.6 | smd 4 x 2.1: GND1 0.884,-4.95; GND3 0.884,4.95 | smd 3.5 x 2.1: GND2 -3.366,-4.95; GND4 -3.366,4.95 | hole 1: -1.016,-2.2; -1.016,2.2
SOT-23-5 = smd 1.2 x 0.55: 1 1.3,-0.95; 2 1.3,0; 3 1.3,0.95; 4 -1.3,0.95; 5 -1.3,-0.95
SOT223 = smd 2.235 x 1.219: 1 3.099,-2.311; 2 3.099,0; 3 3.099,2.311 | smd 2.2 x 3.6: 4 -3.099,0

## Placement (x,y rotation side)
1.2V_CPU  TESTPADTESTPAD_40-ROUND  [TESTPAD_40-ROUND]  54.23,50.55 0 bottom
1.2V_INT  TESTPADTESTPAD_40-ROUND  [TESTPAD_40-ROUND]  49.28,41.02 0 bottom
1.5V  TESTPADTESTPAD_40-ROUND  [TESTPAD_40-ROUND]  46.74,47.88 0 bottom
2.5V  TESTPADTESTPAD_40-ROUND  [TESTPAD_40-ROUND]  22.48,42.93 0 bottom
3.0VA  TESTPADTESTPAD_40-ROUND  [TESTPAD_40-ROUND]  23.11,50.55 0 bottom
3.3V  TESTPADTESTPAD_40-ROUND  [TESTPAD_40-ROUND]  50.04,47.88 0 bottom
5V_E  Opened  [SJ_1_SMALLER]  69.34,52.83 270 bottom
5V_E_SATA  Opened  [SJ_1_SMALLER]  7.49,57.53 0 bottom
5V_SATA_PWR  DW02R  [DW02R]  4.45,54.99 270 top
5VEXT  TESTPADTESTPAD_40-ROUND  [TESTPAD_40-ROUND]  65.79,51.44 0 bottom
+5V  TESTPADTESTPAD_40-ROUND  [TESTPAD_40-ROUND]  9.02,34.92 0 bottom
BACKUP  NA(HN1X2)  [HN1X2]  77.47,1.52 0 top
BAT  TESTPADTESTPAD_40-ROUND  [TESTPAD_40-ROUND]  70.61,42.16 0 bottom
BOX  NA(HAMMOND_1593LBK_A10_LIME_METALBOX)  [HAMMOND_1593LBK_A10_LIME_METALBOX]  0,0 0 top
C1  220nF  [C0402_TI]  59.94,18.29 270 top
C2  220nF  [C0402_TI]  55.12,18.29 270 top
C3  220nF  [C0402_TI]  43.46,24.05 180 bottom
C4  220nF  [C0402_TI]  43.36,25.04 180 bottom
C5  220nF  [C0402_TI]  43.46,27.79 180 bottom
C6  220nF  [C0402_TI]  43.46,28.68 180 bottom
C7  220nF  [C0402_TI]  44.77,25.91 270 bottom
C8  220nF  [C0402_TI]  43.46,31.57 180 bottom
C9  220nF  [C0402_TI]  63.25,21.59 0 bottom
C10  220nF  [C0402_TI]  57.85,22.22 180 bottom
C11  220nF  [C0402_TI]  43.05,33.1 90 bottom
C12  220nF  [C0402_TI]  43.99,33.1 90 bottom
C13  220nF  [C0402_TI]  54.23,18.29 270 top
C14  220nF  [C0402_TI]  61.47,17.91 180 top
C15  22uF/6.3V  [C0603_DWS]  47.12,41.02 180 bottom
C16  220nF  [C0402_TI]  43.46,29.57 0 bottom
C17  220nF  [C0402_TI]  43.46,30.56 0 bottom
C18  220nF  [C0402_TI]  38.28,29.29 270 bottom
C19  220nF  [C0402_TI]  61.21,21.59 0 bottom
C20  220nF  [C0402_TI]  51.18,21.97 0 top
C21  220nF  [C0402_TI]  56.77,25.65 270 bottom
C22  220nF  [C0402_TI]  60.71,39.37 0 bottom
C23  220nF  [C0402_TI]  61.09,32.51 0 bottom
C24  220nF  [C0402_TI]  56.64,39.37 0 bottom
C25  220nF  [C0402_TI]  60.25,22.97 180 bottom
C26  220nF  [C0402_TI]  57.66,36.07 180 bottom
C27  220nF  [C0402_TI]  61.55,25.92 270 bottom
C28  220nF  [C0402_TI]  66.8,28.7 90 bottom
C29  220nF  [C0402_TI]  66.8,37.34 90 top
C30  220nF  [C0402_TI]  66.8,28.7 90 top
C31  220nF  [C0402_TI]  66.8,24.38 90 top
C32  220nF  [C0402_TI]  66.8,30.86 270 top
C33  220nF  [C0402_TI]  66.8,24.38 90 bottom
C34  220nF  [C0402_TI]  66.8,30.86 270 bottom
C35  220nF  [C0402_TI]  64.64,37.97 0 bottom
C36  220nF  [C0402_TI]  66.8,22.22 270 top
C37  220nF  [C0402_TI]  37.21,23.5 90 bottom
C38  220nF  [C0402_TI]  36.53,27.94 0 bottom
C39  220nF  [C0402_TI]  36.19,31.5 180 bottom
C40  220nF  [C0402_TI]  38.28,27.36 270 bottom
C41  220nF  [C0402_TI]  33.86,24.87 180 bottom
C42  220nF  [C0402_TI]  43.36,26.9 0 bottom
C43  220nF  [C0402_TI]  40.79,27.94 180 bottom
C44  220nF  [C0402_TI]  41.17,33.1 270 bottom
C45  220nF  [C0402_TI]  40.23,33.1 270 bottom
C46  220nF  [C0402_TI]  42.11,33.1 270 bottom
C47  220nF  [C0402_TI]  58.67,39.37 180 bottom
C48  220nF  [C0402_TI]  56.9,40.64 180 top
C49  220nF  [C0402_TI]  54.23,39.37 180 bottom
C50  220nF  [C0402_TI]  53.85,40.64 0 top
C51  220nF  [C0402_TI]  58.17,37.59 270 bottom
C52  220nF  [C0402_TI]  51.18,22.86 0 top
C53  220nF  [C0402_TI]  62.74,39.37 0 bottom
C54  220nF  [C0402_TI]  51.18,39.75 90 top
C55  220nF  [C0402_TI]  55.37,31.11 0 bottom
C56  220nF  [C0402_TI]  66.8,33.02 90 top
C57  220nF  [C0402_TI]  66.8,22.3 270 bottom
C58  220nF  [C0402_TI]  66.8,33.02 90 bottom
C59  220nF  [C0402_TI]  66.8,37.34 90 bottom
C60  220nF  [C0402_TI]  66.8,26.54 270 top
C61  220nF  [C0402_TI]  66.8,35.18 270 top
C62  220nF  [C0402_TI]  66.8,26.54 270 bottom
C63  220nF  [C0402_TI]  62.67,37.97 0 bottom
C64  220nF  [C0402_TI]  66.8,35.18 270 bottom
C65  220nF  [C0402_TI]  39.98,23.5 90 bottom
C66  220nF  [C0402_TI]  54.74,49.66 0 bottom
C67  220nF  [C0402_TI]  39.01,23.5 90 bottom
C68  220nF  [C0402_TI]  36.25,23.5 90 bottom
C69  220nF  [C0402_TI]  38.11,23.5 90 bottom
C70  220nF  [C0402_TI]  38.28,25.43 270 bottom
C71  NA(100nF)  [C0402_TI]  6.86,31.5 90 bottom
C72  47uF/6.3V  [C0805_5MIL_DWS]  79.25,30.35 0 top
C73  NA(47uF/6.3V)  [C0805_5MIL_DWS]  71.37,30.86 180 bottom
C74  220nF  [C0402_TI]  39.29,33.1 90 bottom
C75  220nF  [C0402_TI]  36.45,33.1 90 bottom
C76  220nF  [C0402_TI]  38.35,33.15 90 bottom
C77  47uF/6.3V  [C0805_5MIL_DWS]  22.73,13.59 180 top
C78  NA(47uF/6.3V)  [C0805_5MIL_DWS]  77.72,21.08 0 top
C79  47uF/6.3V  [C0805_5MIL_DWS]  81.79,21.59 180 top
C80  NA  [C0402_TI]  52.45,18.29 270 top
C81  NA(24pF)  [C0402_TI]  40.39,17.4 90 bottom
C82  10pF  [C0402_TI]  57.78,18.8 180 bottom
C83  NA(100nF)  [C0402_TI]  24.26,27.43 270 bottom
C84  NA(2.2uF/6.3V/10%/X5R/C0603)  [C0603_DWS]  25.53,27.81 90 bottom
C85  NA(100nF)  [C0402_TI]  23.37,33.78 180 bottom
C86  NA(2.2uF/6.3V/10%/X5R/C0603)  [C0603_DWS]  19.69,34.54 270 bottom
C87  NA(100nF)  [C0402_TI]  20.7,27.43 270 bottom
C88  NA(2.2uF/6.3V/10%/X5R/C0603)  [C0603_DWS]  19.05,28.83 90 bottom
C89  NA(22uF/6.3V)  [C0603_DWS]  18.16,34.54 90 bottom
C92  220nF  [C0402_TI]  33.86,31.32 0 bottom
C93  220nF  [C0402_TI]  38.66,35.08 0 bottom
C94  220nF  [C0402_TI]  33.86,27.69 180 bottom
C95  220nF  [C0402_TI]  43.18,42.29 0 bottom
C96  220nF  [C0402_TI]  38.28,31.22 90 bottom
C97  220nF  [C0402_TI]  43.46,22.99 0 bottom
C98  220nF  [C0402_TI]  41.91,23.5 90 bottom
C99  220nF  [C0402_TI]  40.94,23.5 90 bottom
C100  220nF  [C0402_TI]  35.28,23.5 90 bottom
C106  220nF  [C0402_TI]  33.86,23.95 0 bottom
C107  220nF  [C0402_TI]  33.86,22.99 0 bottom
C108  1uF/10V  [C0603_DWS]  37.34,14.73 180 top
C109  100nF  [C0402_TI]  36.19,16 180 top
C110  22pF  [C0402_TI]  47.37,12.57 270 bottom
C112  NA(100nF)  [C0402_TI]  18.41,41.27 180 top
C113  NA(100nF)  [C0402_TI]  20.7,41.27 0 top
C114  NA(100nF)  [C0402_TI]  20.19,18.41 0 top
C115  22pF  [C0402_TI]  40.77,12.57 270 bottom
C116  33pF  [C0603_DWS]  27.81,20.7 0 bottom
C117  33pF  [C0603_DWS]  24.26,20.7 180 bottom
C118  22uF/6.3V  [C0603_DWS]  48.89,20.07 90 bottom
C119  100nF  [C0402_TI]  43.36,25.93 0 bottom
C120  22uF/6.3V  [C0603_DWS]  31.62,41.02 180 top
C121  220nF  [C0402_TI]  34.01,30.43 180 bottom
C122  22uF/6.3V  [C0603_DWS]  16.38,7.75 0 bottom
C123  22uF/6.3V  [C0603_DWS]  30.05,29.89 270 bottom
C124  22uF/6.3V  [C0603_DWS]  16.38,9.27 0 bottom
C125  1uF/10V  [C0603_DWS]  26.54,44.7 180 bottom
C126  220nF  [C0402_TI]  26.54,42.61 180 bottom
C127  10uF/6.3V  [C0603_DWS]  25.91,41.27 0 top
C128  10uF/6.3V  [C0603_DWS]  25.91,44.32 0 top
C129  220nF  [C0402_TI]  26.54,43.5 180 bottom
C130  220nF  [C0402_TI]  20.19,21.84 180 bottom
C131  220nF  [C0402_TI]  20.19,20.95 180 bottom
C132  220nF  [C0402_TI]  33.15,39.24 270 top
C133  220nF  [C0402_TI]  34.04,39.24 270 top
C134  10uF/6.3V  [C0603_DWS]  35.56,39.37 270 bottom
C135  100nF  [C0402_TI]  26.8,12.32 270 bottom
C136  100nF  [C0402_TI]  18.41,13.84 180 bottom
C137  100nF  [C0402_TI]  18.92,11.56 270 bottom
C138  22uF/6.3V  [C0603_DWS]  22.48,13.84 0 bottom
C139  1nF  [C0402_TI]  23.88,50.04 270 top
C140  1nF  [C0402_TI]  26.54,48.51 0 bottom
C141  1nF  [C0402_TI]  22.86,50.04 270 top
C142  1nF  [C0402_TI]  26.54,47.62 0 bottom
C143  22uF/6.3V  [C0603_DWS]  19.69,19.68 180 bottom
C144  220nF  [C0402_TI]  33.86,26.8 180 bottom
C145  22uF/6.3V  [C0603_DWS]  50.67,42.67 90 top
C146  10uF/6.3V  [C0603_DWS]  78.36,28.45 0 bottom
C147  22uF/6.3V  [C0603_DWS]  78.36,30.35 180 bottom
C148  220nF  [C0402_TI]  33.86,25.83 180 bottom
C149  100nF  [C0402_TI]  77.47,33.66 270 bottom
C150  10uF/6.3V  [C0603_DWS]  78.36,20.7 0 bottom
C151  22uF/6.3V  [C0603_DWS]  78.36,22.22 180 bottom
C152  100nF  [C0402_TI]  77.47,26.54 90 bottom
C153  10nF  [C0402_TI]  8.64,40.13 0 bottom
C154  10nF  [C0402_TI]  8.64,41.02 0 bottom
C155  10uF/6.3V  [C0603_DWS]  71.37,39.5 0 bottom
C156  10nF  [C0402_TI]  8.64,43.94 0 bottom
C157  10nF  [C0402_TI]  8.64,44.83 0 bottom
C158  10uF/6.3V  [C0603_DWS]  65.66,39.32 180 bottom
C159  1uF/10V  [C0603_DWS]  72.9,46.23 0 bottom
C160  10uF/6.3V  [C0603_DWS]  75.31,41.66 270 top
C161  10uF/6.3V  [C0603_DWS]  72.9,47.75 180 bottom
C162  10uF/6.3V  [C0603_DWS]  69.98,48.13 90 bottom
C163  10uF/6.3V  [C0603_DWS]  64.9,42.29 0 bottom
C164  220nF  [C0402_TI]  37.39,33.1 90 bottom
C165  22uF/6.3V  [C0603_DWS]  43.81,41.02 0 bottom
C166  10uF/6.3V  [C0603_DWS]  52.96,50.04 90 top
C167  1nF  [C0402_TI]  54.36,50.42 90 top
C168  22uF/6.3V  [C0603_DWS]  7.49,54.99 90 bottom
C169  NA(22uF/6.3V)  [C0603_DWS]  5.97,54.99 90 bottom
C170  10uF/6.3V  [C0603_DWS]  66.93,51.18 0 top
C171  1uF/10V  [C0603_DWS]  58.93,41.53 90 bottom
C172  10uF/6.3V  [C0603_DWS]  53.47,44.45 90 top
C173  1nF  [C0402_TI]  52.2,44.45 90 top
C174  10uF/6.3V  [C0603_DWS]  60.2,49.02 90 bottom
C175  22uF/6.3V  [C0603_DWS]  7.49,51.69 90 bottom
C176  1uF/10V  [C0603_DWS]  62.1,42.93 270 bottom
C177  22uF/6.3V  [C0603_DWS]  24.77,37.21 0 bottom
C178  220nF  [C0402_TI]  33.86,29.54 180 bottom
C179  10uF/6.3V  [C0603_DWS]  62.1,46.23 90 bottom
C180  1uF/10V  [C0603_DWS]  59.56,40.83 0 top
C181  22uF/6.3V  [C0603_DWS]  49.15,42.67 90 top
C182  10uF/6.3V  [C0603_DWS]  60.45,41.53 90 bottom
C183  10uF/6.3V  [C0603_DWS]  58.67,49.02 90 bottom
C184  220nF  [C0402_TI]  33.86,28.58 180 bottom
C185  10uF/6.3V  [C0603_DWS]  71.88,42.55 0 top
C186  10uF/6.3V  [C0603_DWS]  71.88,41.02 0 top
C187  1nF  [C0402_TI]  69.98,48.64 270 top
C188  10uF/6.3V  [C0603_DWS]  56.52,49.02 90 bottom
C189  220nF  [C0402_TI]  33.63,33.1 270 bottom
C190  22uF/6.3V  [C0603_DWS]  24.77,35.69 0 bottom
C191  22uF/6.3V  [C0603_DWS]  19.43,50.55 0 top
C192  22uF/6.3V  [C0603_DWS]  19.69,43.69 180 top
C193  100nF  [C0402_TI]  20.07,44.96 180 top
C194  220nF  [C0402_TI]  35.51,33.1 270 bottom
C195  22uF/6.3V  [C0603_DWS]  35.18,44.07 0 top
C196  220nF  [C0402_TI]  34.57,33.1 270 bottom
C197  470nF  [C0603_DWS]  35.18,42.55 0 top
C198  22uF/6.3V  [C0603_DWS]  31.62,42.55 180 top
C199  470nF  [C0603_DWS]  35.18,41.02 0 top
C200  470uF/10V/105C  [E2,5-6,3]  69.09,56.13 90 top
C201  33pF  [C0603_DWS]  46.74,45.72 270 bottom
C202  22uF/6.3V  [C0603_DWS]  54.36,41.47 90 bottom
C203  22uF/6.3V  [C0603_DWS]  51.82,45.72 270 bottom
C204  22uF/6.3V  [C0603_DWS]  53.34,45.72 270 bottom
C205  22uF/6.3V  [C0603_DWS]  77.72,42.55 180 bottom
C206  22uF/6.3V  [C0603_DWS]  77.72,41.02 180 bottom
C207  22uF/6.3V  [C0603_DWS]  79.12,42.67 0 top
C208  22uF/6.3V  [C0603_DWS]  77.22,48.39 180 bottom
C209  1nF  [C0402_TI]  29.21,54.48 90 top
C210  22uF/6.3V  [C0603_DWS]  31.75,52.96 90 bottom
C211  33pF  [C0603_DWS]  25.78,57.78 270 top
C212  22uF/6.3V  [C0603_DWS]  26.54,57.78 270 bottom
C213  22uF/6.3V  [C0603_DWS]  25.02,57.78 270 bottom
C214  1nF/2kV/X7R/1206  [C1206_5MILS_WS_ISO]  70.36,20.07 180 bottom
C220  22uF/6.3V  [C0603_DWS]  72.14,33.66 180 bottom
C221  NA(22uF/6.3V)  [C0603_DWS]  73.66,23.24 90 bottom
C222  22uF/6.3V  [C0603_DWS]  72.14,23.24 90 bottom
C223  NA(22uF/6.3V)  [C0603_DWS]  70.61,23.24 90 bottom
C224  47uF/6.3V  [C0805_5MIL_DWS]  6.22,54.23 90 top
C232  47uF/6.3V  [C0805_5MIL_DWS]  8.26,54.23 90 top
C236  100nF  [C0402_TI]  64.9,16.13 0 bottom
C237  100nF  [C0402_TI]  59.06,6.73 90 top
C238  47uF/6.3V  [C0805_5MIL_DWS]  52.83,18.16 270 bottom
C239  100nF  [C0402_TI]  54.61,7.49 180 bottom
C240  100nF  [C0402_TI]  53.47,9.91 90 bottom
C241  22uF/6.3V  [C0603_DWS]  55.37,5.71 180 bottom
C242  100nF  [C0402_TI]  54.99,18.03 180 bottom
C243  100nF  [C0402_TI]  53.7,13.59 180 bottom
C244  100nF  [C0402_TI]  64.64,9.27 0 bottom
C245  47uF/6.3V  [C0805_5MIL_DWS]  50.55,18.29 270 top
C246  22uF/6.3V  [C0603_DWS]  61.85,11.56 0 top
C247  100nF  [C0402_TI]  64.9,13.59 0 bottom
C248  33pF  [C0603_DWS]  65.79,20.07 0 bottom
C249  33pF  [C0603_DWS]  57.02,20.32 180 bottom
C250  100nF  [C0402_TI]  61.47,17.02 180 top
C251  NA(10uF/6.3V)  [C0603_DWS]  60.2,1.02 0 bottom
C252  100nF  [C0402_TI]  64.9,12.83 0 top
C253  100nF  [C0402_TI]  64.9,11.94 0 top
C254  NA(24pF)  [C0402_TI]  49.4,11.43 270 bottom
C256  22uF/6.3V  [C0603_DWS]  56.9,7.49 180 top
C257  22uF/6.3V  [C0603_DWS]  60.71,13.97 270 top
C258  22uF/6.3V  [C0603_DWS]  64.14,18.41 0 top
CHGLED  LED/YELLOW/0603  [LED-0603_TEST]  77.85,41.02 0 top
D1  1N5819(S4SOD-123)  [SOD-123]  17.4,50.16 90 bottom
D2  1N5819(S4SOD-123)  [SOD-123]  69.22,3.56 0 bottom
D3  SMBJ6.0A  [DO214AA]  77.47,45.21 0 top
D4  NA(1N5822/SS34/SMA)  [MLL-41]  77.6,58.29 0 bottom
D5  1N5822/SS34/SMA  [MELF-MLL41]  80.39,38.73 180 bottom
D6  1N4007/SMA  [MELF-MLL41]  62.1,9.27 0 top
D7  1N4148/SOD80C  [MINI-MELF]  12.06,36.7 90 top
DS  TESTPADTESTPAD_40-ROUND  [TESTPAD_40-ROUND]  22.23,27.94 0 bottom
FET1  IRLML6402  [SOT23]  10.29,57.28 270 bottom
FET2  BSS138  [SOT23]  71.88,53.34 270 bottom
FET3  IRLML6402  [SOT23]  71.88,57.4 0 bottom
FET4  IRLML6402  [SOT23]  71.5,51.31 90 top
FUSE1  FSMD035  [1206]  11.68,32.77 270 bottom
GND  TESTPADTESTPAD_40-ROUND  [TESTPAD_40-ROUND]  17.27,58.67 0 bottom
GND_PIN  TESTPAD3  [TEST_PAD40/70/SQUARE]  26.16,1.27 0 top
GPIO-1  PA-V16X-2X20-LF  [GPH127SMT-02X20(PA-V16X-2X20-LF)_TEST]  38.1,50.16 0 top
GPIO-2  PA-V16X-2X20-LF  [GPH127SMT-02X20(PA-V16X-2X20-LF)_TEST]  38.1,9.52 0 top
GPIO-3  PA-V16X-2X20-LF  [GPH127SMT-02X20(PA-V16X-2X20-LF)_TEST]  45.08,3.17 0 top
GPIO-4  PA-V16X-2X10-LF  [GPH127SMT-02X10(PA-V16X-2X10-LF)_TEST]  14.86,53.09 90 top
HDMI  HDMI-SWM-19  [HDMI-SWM-19_TEST]  4.19,25.27 90 top
IPSOUT  TESTPADTESTPAD_40-ROUND  [TESTPAD_40-ROUND]  58.8,45.59 0 bottom
L1  FB0805/600R/2A  [L0805_5MIL_DWS]  50.8,18.16 270 bottom
L2  FB0805/600R/2A  [L0805_5MIL_DWS]  62.48,14.35 270 top
L3  NA(2.7nH/0402)  [L0402_TI]  39.5,16.76 270 bottom
L4  NA(2.7nH/0402)  [L0402_TI]  51.74,12.19 0 bottom
L5  FB0805/600R/2A  [L0805_5MIL_DWS]  16.13,5.21 0 bottom
L6  FB0805/600R/2A  [L0805_5MIL_DWS]  19.94,15.62 180 bottom
L7  FB0805/600R/2A  [L0805_5MIL_DWS]  9.4,3.17 270 top
L8  FB0805/600R/2A  [L0805_5MIL_DWS]  78.99,33.15 90 bottom
L9  FB0805/600R/2A  [L0805_5MIL_DWS]  71.78,27.84 0 bottom
L10  FB0805/600R/2A  [L0805_5MIL_DWS]  78.99,25.02 90 bottom
L11  2.2uH/1.5A/DCR<0.1R/CD32  [CD32]  72.39,46.23 270 top
L12  2.2uH/1.5A/DCR<0.1R/CD32  [CD32]  56.77,50.93 270 top
L13  2.2uH/1.5A/DCR<0.1R/CD32  [CD32]  56.26,45.21 270 top
L14  2.2uH/1.5A/DCR<0.1R/CD32  [CD32]  56.13,45.21 90 bottom
L15  2.2uH/1.5A/DCR<0.1R/CD32  [CD32]  81.41,47.37 270 bottom
L16  2.2uH/1.5A/DCR<0.1R/CD32  [CD32]  30.35,57.4 0 bottom
L17  NA(FB0805/600R/2A)  [L0805_5MIL_DWS]  16.38,34.54 270 bottom
L18  FB0805/600R/2A  [L0805_5MIL_DWS]  65.02,15.62 90 top
LAN  TM211Q01FM22_SH  [TM211Q01FM22_SH]  76.96,12.06 270 top
LCD_CON  PA-V16X-2X20-LF  [GPH127SMT-02X20(PA-V16X-2X20-LF)_TEST]  45.08,56.52 0 top
LED1  LED/GREEN/0603  [LED-0603_TEST]  28.7,2.16 90 top
LIPO_BAT  DW02R  [DW02R]  81.53,43.43 90 top
NAND_E  Closed  [SJ_1_SMALLER_CLOSE_10MILS]  20.95,37.72 0 bottom
PC3/PB8  PC3:Closed/PB8:Opened  [SJ_2_SMALL_23_TIED]  10.29,47.24 180 bottom
PWR  SIDE_WTCM-TR(3X4)  [SW_TAKT3X4]  1.4,54.36 90 bottom
PWR_JACK  PWRJ-2mm(YDJ-1134)  [PWR_JACK_UNI_MILLING_SMALLER_DRILLS]  74.55,56.64 180 top
PWR_LED  LED/RED/0603  [LED-0603_TEST]  78.61,58.55 180 top
Q2  Q32.768kHz/12.5pF/20ppm/4P/SMD8038  [MC-306_TEST]  44.07,9.02 270 bottom
Q3  Q24MHz/20pF/20ppm/2P/5x3.2mm  [HCX-4S_TEST]  26.16,23.37 180 bottom
Q4  Q25MHz/20pF/30ppm/4P/3.2x2.5  [NX3225SA]  60.83,18.8 180 bottom
R1  2k/1%  [R0402_TI]  59.06,18.29 90 top
R2  2k/1%  [R0402_TI]  56.01,18.29 90 top
R3  NA  [R0402_TI]  57.53,18.8 180 top
R4  2k/1%  [R0402_TI]  61.47,18.8 180 top
R5  2k/1%  [R0402_TI]  53.34,18.29 270 top
R6  2k/1%  [R0402_TI]  46.36,37.85 0 bottom
R7  330R/1%  [R0603_5MIL_DWS]  63.65,35.49 0 bottom
R8  330R/1%  [R0603_5MIL_DWS]  62.25,24.19 0 bottom
R9  22R  [R0402_TI]  50.29,32.89 180 top
R10  22R  [R0402_TI]  50.29,33.78 180 top
R11  0R(Board_Mounted)  [R0402_TI_0R]  46.36,36.96 0 bottom
R12  NA(10k)  [R0402_TI]  5.33,30.99 180 bottom
R13  0R(Board_Mounted)  [R0402_TI_0R]  46.36,36.07 0 bottom
R14  330R/1%  [R0603_5MIL_DWS]  43.81,39.5 0 bottom
R15  NA  [R0402_TI]  2.92,19.56 180 bottom
R16  NA(10k)  [R0402_TI]  5.08,19.56 0 bottom
R17  NA(10k)  [R0402_TI]  7.24,19.56 180 bottom
R19  33R  [R0402_TI]  44.45,19.43 90 bottom
R20  33R  [R0402_TI]  42.67,19.43 90 bottom
R21  33R  [R0402_TI]  43.56,19.43 90 bottom
R22  NA(10k)  [R0402_TI]  22.73,41.27 0 top
R23  NA(10k)  [R0402_TI]  21.72,42.16 0 top
R24  33R  [R0402_TI]  41.28,19.43 90 bottom
R25  33R  [R0402_TI]  40.39,19.43 90 bottom
R26  33R  [R0402_TI]  39.5,19.43 90 bottom
R27  47k  [R0402_TI]  19.05,48.89 270 bottom
R28  NA  [R0402_TI]  18.8,37.72 0 bottom
R29  NA(10k)  [R0402_TI]  18.41,42.16 180 top
R30  47k  [R0402_TI]  36.19,16.89 0 top
R31  10k  [R0402_TI]  12.19,30.86 0 top
R32  27k  [R0402_TI]  12.19,33.53 180 top
R33  NA(22R)  [R0402_TI]  22.1,24 90 bottom
R34  NA(10k)  [R0402_TI]  18.29,25.78 270 bottom
R35  10M  [R0402_TI]  44.83,14.35 90 bottom
R36  NA(10k)  [R0402_TI]  21.59,35.56 0 bottom
R37  NA(10k)  [R0402_TI]  22.73,31.62 270 bottom
R39  NA(2.2k)  [R0402_TI]  46.86,2.29 90 bottom
R40  NA(2.2k)  [R0402_TI]  45.72,2.29 270 bottom
R41  100k/1%  [R0603_5MIL_DWS]  16.38,12.32 180 bottom
R42  10k  [R0402_TI]  16.38,10.54 180 bottom
R43  200k/1%  [R0603_5MIL_DWS]  25.91,42.8 180 top
R44  10k  [R0402_TI]  5.84,17.78 90 bottom
R45  2k/1%  [R0402_TI]  12.19,32.64 180 top
R46  2k/1%  [R0402_TI]  12.19,31.75 180 top
R47  20k/5%/0402  [R0402_TI]  12.32,28.58 270 bottom
R48  NA(0R)  [R0603_5MIL_DWS]  42.61,40.39 90 top
R49  NA  [R0402_TI]  49.4,55.63 270 bottom
R50  NA  [R0402_TI]  53.09,58.17 0 bottom
R51  4.99k/1%  [R0603_5MIL_DWS]  23.62,15.49 0 bottom
R52  10k  [R0402_TI]  21.08,9.14 0 bottom
R53  13k/1%  [R0603_5MIL_DWS]  24.51,9.91 270 bottom
R54  10k  [R0402_TI]  25.91,12.32 90 bottom
R55  47k  [R0402_TI]  10.92,3.17 90 top
R56  2.2k  [R0402_TI]  45.34,45.72 270 bottom
R57  2.2k  [R0402_TI]  45.21,52.07 0 bottom
R58  10k  [R0402_TI]  82.04,28.45 180 bottom
R59  6.8k/1%  [R0603_5MIL_DWS]  81.79,34.29 180 bottom
R60  2.2k  [R0402_TI]  51.18,48.51 270 bottom
R61  2.2k  [R0402_TI]  52.07,48.51 270 bottom
R62  10k  [R0402_TI]  82.04,20.57 180 bottom
R63  13k/1%  [R0603_5MIL_DWS]  81.79,26.16 180 bottom
R64  10k  [R0402_TI]  64.14,0.89 0 bottom
R65  191R/1%  [R0603_5MIL_DWS]  71.88,39.5 180 top
R66  0.03R/1%  [R1206_5MIL_WS]  72.64,42.93 90 bottom
R67  100k/1%  [R0603_5MIL_DWS]  82.68,54.99 270 bottom
R68  10k  [R0402_TI]  10.29,54.48 180 bottom
R69  200k/1%  [R0603_5MIL_DWS]  82.68,51.18 270 bottom
R70  2.2k  [R0402_TI]  78.61,39.75 180 top
R71  10k  [R0402_TI]  9.78,48.89 180 bottom
R72  191R/1%  [R0603_5MIL_DWS]  25.91,41.4 180 bottom
R73  6.8k/1%  [R0603_5MIL_DWS]  5.97,51.69 270 bottom
R74  200k/1%  [R0603_5MIL_DWS]  59.56,42.35 0 top
R75  2.2k  [R0402_TI]  69.09,48.64 270 top
R76  47k  [R0402_TI]  65.53,57.4 90 bottom
R77  2.2k  [R0402_TI]  66.93,49.91 180 top
R78  10k  [R0402_TI]  72.52,50.16 0 bottom
R79  2.2k  [R0402_TI]  67.18,51.18 90 bottom
R80  2.2k  [R0402_TI]  62.61,40.32 0 bottom
R81  2.2k  [R0402_TI]  68.07,51.18 90 bottom
R82  2.2k  [R0402_TI]  75.82,58.55 0 top
R83  0R(Board_Mounted)  [0603_0R]  66.8,56.77 270 bottom
R84  1M  [R0402_TI]  74.17,49.02 0 bottom
R85  8.25k/1%  [R0603_5MIL_DWS]  75.31,41.66 270 bottom
R86  12.4k/1%  [R0603_5MIL_DWS]  48.77,45.72 270 bottom
R87  100k/1%  [R0603_5MIL_DWS]  30.48,55.12 270 top
R88  2.2k  [R0402_TI]  29.97,2.54 90 top
R89  1.1k/1%  [R0603_5MIL_DWS]  75.31,45.97 90 bottom
R90  10k/1%  [R0603_5MIL_DWS]  47.88,43.31 0 bottom
R91  4.99k/1%  [R0603_5MIL_DWS]  27.3,57.78 270 top
R92  1.1k/1%  [R0603_5MIL_DWS]  26.92,53.72 90 bottom
R93  NA(2.2k)  [R0402_TI]  30.61,12.32 270 bottom
R94  NA(2.2k)  [R0402_TI]  31.88,12.32 270 bottom
R95  NA(2.2k)  [R0402_TI]  32.77,12.32 270 bottom
R96  NA(2.2k)  [R0402_TI]  29.72,12.32 270 bottom
R111  12.1k/1%  [R0603_5MIL_DWS]  64.9,18.54 0 bottom
R112  NA  [R0402_TI]  58.93,2.29 180 bottom
R113  1k  [R0402_TI]  59.82,1.52 90 top
R114  1k  [R0402_TI]  65.79,6.73 270 bottom
R115  1k  [R0402_TI]  79.76,3.43 90 bottom
R116  1k  [R0402_TI]  64.39,8.25 180 bottom
R117  1k  [R0402_TI]  80.77,3.43 90 bottom
R118  1k  [R0402_TI]  53.72,15.62 0 bottom
R119  33R  [R0402_TI]  50.29,12.57 270 bottom
R120  33R  [R0402_TI]  51.44,10.67 0 bottom
R121  10k  [R0402_TI]  51.05,15.75 0 top
R122  NA  [R0402_TI]  58.93,1.52 90 top
R123  33R  [R0402_TI]  57.78,17.78 180 bottom
R124  1k  [R0402_TI]  51.74,13.08 180 bottom
R125  1k  [R0402_TI]  58.29,16.13 0 top
R126  10k  [R0402_TI]  54.99,17.14 180 bottom
R127  120R  [R0402_TI]  53.72,7.62 180 top
R128  2.2k  [R0402_TI]  58.8,58.17 180 bottom
R129  2.2k  [R0402_TI]  44.32,45.72 270 bottom
RECOVERY  SIDE_WTCM-TR(3X4)  [SW_TAKT3X4]  1.4,37.85 90 bottom
RESET  SIDE_WTCM-TR(3X4)  [SW_TAKT3X4]  1.4,46.1 90 bottom
RM1  RA1206_(4X0603)_4B8_0R  [R_MATRIX_4]  52.2,53.97 180 bottom
RM2  NA(RA1206_(4X0603)_4B8_0R)  [R_MATRIX_4]  57.02,53.72 0 bottom
RM3  RA1206_(4X0603)_4B8_100K  [R_MATRIX_4]  16.38,2.16 270 bottom
RM4  RA0805_(4X0402)_4B8_4.7k  [R_MATRIX_4_0402_25X625_BIGGEROUTPADS]  49.78,2.67 180 bottom
RM9  RA1206_(4X0603)_4B8_33R  [R_MATRIX_4]  51.18,6.35 180 bottom
RM10  RA1206_(4X0603)_4B8_4.7k  [R_MATRIX_4]  54.23,1.78 180 bottom
SATA  SATA-PWA-07  [SATA-PWA-07-TEST]  3.98,42.91 90 top
SD/MMC  MICRO_SD/TFC-WPAPR-08  [TFC-WPAPR-08_BIGGER_CREAM]  5.84,8.64 0 bottom
T1  BC846B  [SOT23]  10.29,51.69 0 bottom
U1  A20  [TFBGA441]  38.65,28.29 90 top
U2  MT41K256M16HA-125:E(DDR3L-1600_11-11-11)  [FBGA96_SK]  59.05,35.19 0 top
U3  MT41K256M16HA-125:E(DDR3L-1600_11-11-11)  [FBGA96_SK]  59.05,24.29 0 top
U4  NA(H27UBG8T2BTR_or_MT29F64G08CBABAWP:BTR(8GB_NAND))  [TSOP48]  20.19,29.84 270 top
U5  KSZ9031RNXCC-TR  [QFN48_1DRILL(PADPITCH-0.5MM)]  59.18,12.32 270 bottom
U6  AT24C16C-SSHM-T(SOIC-8)  [SO-08MN]  37.08,4.83 180 bottom
U7  NA(RCLAMP0524P)  [SLP2510P8_TEST]  12.19,22.35 90 top
U8  NA(RCLAMP0524P)  [SLP2510P8_TEST]  12.19,25.4 90 top
U9  NA(RCLAMP0524P)  [SLP2510P8_TEST]  12.19,28.32 90 top
U10  SY6280AAC(SOT23-5)  [SOT23-5]  21.46,11.43 180 bottom
U11  SY6280AAC(SOT23-5)  [SOT23-5]  81.53,31.37 90 bottom
U12  SY6280AAC(SOT23-5)  [SOT23-5]  81.53,23.24 90 bottom
U13  AXP209(QFN48)  [QFN48]  65.15,44.96 180 top
U14  MCP120T475I-TT  [SOT23]  77.72,51.82 270 bottom
U15  SY8089AAAC(SOT23-5)  [SOT23-5]  51.82,41.91 90 bottom
U16  MT3608(SOT23-6)  [SOT23-6]  77.72,45.47 270 bottom
U17  SY8089AAAC(SOT23-5)  [SOT23-5]  29.34,52.32 90 bottom
U18  FIDUCIAL  [FIDUCIAL-1X3]  10.41,56.64 180 top
U19  FIDUCIAL  [FIDUCIAL-1X3]  82.42,1.52 180 top
U20  FIDUCIAL  [FIDUCIAL-1X3]  7.49,38.1 0 bottom
U21  FIDUCIAL  [FIDUCIAL-1X3]  82.42,1.52 0 bottom
U22  NA(W25Q128FVSIG(EN25Q64-104HIP))  [SO-8-BIG]  4.19,25.27 0 bottom
U23  NA(KLMAG2GEND-B031(FBGA153))  [FBGA153]  20.25,30.44 90 top
U$1  [ATTENTION_SMALL]  81.79,54.1 0 bottom
U$5  [LOGO-OPENHARDWARE_8X8]  33.02,18.41 0 bottom
U$6  [OLIMEX1_V]  47.5,26.42 0 bottom
U$9  [PB]  75.06,11.81 0 bottom
U$10  [ESD_SYMBOL]  34.42,0.51 0 bottom
U$11  [RECYCLE_BIN1/8]  83.31,9.02 0 bottom
U$12  [ROHS]  36.32,42.04 90 bottom
UART0  HN1X3  [HN1X3]  69.85,1.52 0 top
USB_HOST1  USB_A_VERTICAL  [USB_A_VERTICAL_PTH]  87.88,32.26 90 top
USB_HOST2  USB_A_VERTICAL  [USB_A_VERTICAL_PTH]  87.88,22.61 90 top
USB_OTG  USB-OTG(MSB-SW-5AB-LF)  [USB_MINI_9PIN]  3.05,7.63 180 top
VR1  AP1231-2.5V(SOT23-5)  [SOT-23-5]  19.94,47.62 90 top
VR3  AMS1117  [SOT223]  54.74,12.83 270 top
WP_ENABLE  Opened  [SJ_1_SMALLER]  0.89,19.3 90 bottom

## Tracks (layer width: path | path; a pad name or v marks a point on that pad's centre or on a via)
1.25_EXT
  Top 0.508: VR3.2 54.23,9.73 R127.1
  Top 1.27: L18.1 64.26,14.6 63.88,14.99 62.86,14.99 L2.1 61.21,15.37 C257.1 58.8,14.86 | VR3.2 54.74,12.45 | VR3.4 53.59,15.93 53.59,14.6
  Top 1.524: VR3.4 55.8,14.86 58.8,14.86
  pour Top (isolate 0.305, no thermals): 51.56,17.14 51.56,10.16 53.59,10.29 53.59,9.14 55.88,9.14 55.88,10.29 60.2,10.29 60.2,11.43 65.79,11.43 65.79,17.14
5VEXT  (via drill 0.6)
  Top 0.203: U13.32 65.75,41.25 65.76,41.24 65.76,41 65.96,41 66.15,41 U13.33
  Top 0.508: 74.68,54.48 74.68,57.91 R82.1 | PWR_JACK.+ 74.75,50.29
  Top 0.61: v66.22,40.26 65.96,40.51 65.96,41
  Top 0.762: 74.75,50.29 74.55,50.1 74.55,46.74 75.29,45.99 D3.C
  Top 1.016: PWR_JACK.+ 74.68,51.96 74.68,54.48
  Route3 1.524: PWR_JACK.+ 74.75,52.89 73.53,54.1 69.85,54.1 C200.+
  Route14 0.813: v66.22,40.26 66.22,41.2
  Route14 1.016: 66.22,41.2 66.22,41.71 68.58,44.07 68.58,46.23 69.85,47.5 72.77,47.5 74.3,49.02 74.3,49.53 74.75,49.98 PWR_JACK.+
  Bottom 0.254: C200.+ 68.2,54.86 65.79,52.45 5VEXT.1
  Bottom 0.508: 69.34,53.34 5V_E.1
  Bottom 0.61: 74.8,50.42 74.8,50.16 R78.1
  Bottom 0.762: C200.+ 69.34,54.61 69.34,53.34 | C158.2 66.22,39.65 v66.22,40.26 | 74.8,50.42 74.8,50.67 76.77,50.67 U14.2
  Bottom 1.016: 74.8,50.42 74.75,50.42 PWR_JACK.+ 74.75,53.4 74.3,53.85 74.3,57.4 | D4.A 75.06,58.29 74.3,57.53 74.3,57.4 | 74.3,57.4 FET3.3
+5V  (via drill 0.4, 0.6)
  Top 0.406: v10.29,34.04 10.29,33.66 11.18,32.77 11.56,32.77 R45.2
  Top 0.508: v26.03,49.4 GPIO-1.1
  Top 0.61: R45.2 R46.2 | v33.02,55.75 LCD_CON.1
  Top 0.762: v26.03,8.76 GPIO-2.1 | v33.02,2.41 GPIO-3.1
  Top 0.889: v69.47,51.44 70.44,52.41 FET4.2
  Top 1.016: v10.29,34.04 v10.29,34.92
  Route3 0.762: v69.6,58.8 70.1,58.8 70.23,58.67
  Route3 1.016: v81.41,58.29 70.61,58.29 70.23,58.67
  Route4 0.762: v69.6,58.8 70.23,58.8 70.36,58.67
  Route4 1.016: 70.36,58.67 70.61,58.42 70.61,52.58 v69.47,51.44
  Route13 0.508: 18.29,11.81 v18.29,12.06 | 18.92,11.81 19.18,11.81 v19.18,12.7
  Route13 0.762: 32.77,2.41 v33.02,2.41 | 25.4,8.76 v26.03,8.76 | 33.02,55.63 v33.02,55.75 | 25.91,49.4 v26.03,49.4
  Route13 1.016: 32.77,2.41 32.39,2.79 30.23,2.79 28.07,4.95 28.07,6.1 25.4,8.76 23.11,11.05 21.08,11.05 20.32,11.81 19.18,11.81 | 68.71,51.44 68.71,49.78 78.36,40.13 78.36,37.47 80.26,35.56 80.26,34.54 81.53,33.27 81.53,30.99 80.26,29.72 v80.26,28.45 | 33.02,54.23 33.02,55.63 | 33.02,54.23 31.5,52.7 26.16,52.7 24.38,50.93 | 24.38,50.93 23.37,49.91 20.32,49.91 16.64,46.23 13.34,46.23 12.83,46.74 9.52,46.74 | 9.52,46.74 9.52,35.69 v10.29,34.92 v10.29,34.04 10.92,33.4 10.92,32 9.27,30.35 9.27,28.45 6.35,25.53 6.35,14.48 9.52,11.3 12.57,11.3 13.59,12.32 16.26,12.32 16.76,11.81 18.29,11.81 18.92,11.81 | 9.52,46.74 9.52,56.64 v8.64,57.53 | 33.02,54.23 55.88,54.23 59.56,50.55 62.74,50.55 63.63,51.44 68.71,51.44 | 68.71,51.44 v69.47,51.44 | 24.38,50.93 25.91,49.4
  Route14 1.016: v80.26,28.45 80.26,26.42 78.99,25.15 78.99,21.59 v80.52,20.07
  Bottom 0.406: v10.29,34.92 +5V.1
  Bottom 0.508: 80.01,28.45 80.01,29.34 80.39,29.72 80.58,29.72 U11.5 | v80.52,20.07 80.58,20.13 U12.5 | 8,57.53 5V_E_SATA.1 | U10.5 19.49,12.38 19.18,12.06 | v18.29,12.06 C137.1 19.18,12.06 | 19.18,12.06 v19.18,12.7 | 69.34,52.32 5V_E.2 | v69.6,58.8 66.17,58.8 65.53,58.17 R76.2
  Bottom 0.61: FET1.2 9.78,55.73 R68.1
  Bottom 0.762: 8,57.53 v8.64,57.53 9.34,56.83 FET1.2 | v69.47,51.44 69.34,51.56 69.34,52.32 | FET3.2 70.33,58.8 v69.6,58.8
  Bottom 0.813: FUSE1.1 11.55,34.04 v10.29,34.04
  Bottom 1.016: v80.52,20.07 80.52,20.7 C150.1 | v80.26,28.45 80.01,28.45 C146.1 | v81.41,58.29 D4.K | v10.29,34.04 v10.29,34.92
+5V_OTG_PWR  (via drill 0.4, 0.6)
  Top 0.203: 65.23,41.05 65.23,41.07 | 65.23,41.07 65.23,41.25 65.35,41.37 | 65.35,41.37 U13.31 | 65.35,41.37 65.35,41.2 65.23,41.07
  Top 0.508: v65.23,40.28 v65.23,40.89 65.23,41.05 | USB_OTG.VBUS 7.07,9.52 7.62,9.52
  Top 1.016: 7.62,9.52 8.89,9.52 11.68,12.32 v11.68,13.46
  Route4 0.635: v65.23,40.28 65.23,40.97 65.41,41.15
  Route4 1.016: v82.68,56.9 82.04,56.9 79.12,53.97 79.12,50.8 75.95,47.62 69.98,47.62 68.58,46.23 68.58,44.32 65.41,41.15
  Route13 0.61: v65.23,40.28 v65.23,40.89 65.23,41.2 65.15,41.27
  Route13 1.016: 65.15,41.27 64.39,42.04 59.44,42.04 58.42,43.05 51.05,43.05 48.13,40.13 42.55,40.13 40.89,41.78 37.08,41.78 35.81,40.51 34.29,40.51 33.66,39.88 15.62,39.88 12.95,37.21 12.95,31.5 10.92,29.46 10.92,14.22 v11.68,13.46
  Bottom 0.508: v65.23,40.28 v65.23,40.89 65.23,40.94 64.01,42.16 C163.2
  Bottom 0.61: 17.78,13.97 C136.1
  Bottom 0.762: 13.08,13.46 17.27,13.46 17.78,13.97 17.78,14.48 L6.1
  Bottom 1.016: v11.68,13.46 13.08,13.46 | v82.68,56.9 R67.1
+24V  (via drill 0.4, 0.6)
  Top 0.203: U13.38 68.91,43.16 68.91,43.36 68.91,43.56 U13.39 | v70.1,44.45 69.85,44.45 69.54,44.76 U13.42
  Top 0.61: 68.91,43.36 68.99,43.36 v69.16,43.18 v69.16,42.56
  Top 1.016: LIPO_BAT.1 80.25,42.43 C207.2
  Route3 1.016: v72.52,48.89 72.52,48.01 78.11,42.42 81.55,42.42 LIPO_BAT.1
  PWR 0.508: v69.16,42.56 69.16,43.13
  Bottom 0.254: v69.16,42.56 70.22,42.56 BAT.1
  Bottom 0.61: v69.16,42.56 69.16,42.67 | v72.52,48.89 72.52,49.02
  Bottom 0.813: 69.16,42.67 v69.16,43.18 69.16,43.51 v70.1,44.45 70.48,44.83 72.01,44.83
  Bottom 1.016: R66.2 72.2,44.83 72.01,44.83 C159.2 C161.1 72.01,48.01 72.52,48.51 v72.52,48.89
AVDDL(1.2)  (via drill 0.3)
  Top 0.508: v60.2,16.89 60.33,17.02 C250.2 | 63.5,11.43 v63.88,11.05 v64.39,11.05 | 62.61,13.21 62.61,13.46 v63.75,13.46
  Top 0.762: C246.2 62.86,11.43 63.5,11.43